# Altium project Rocket_PCB_Project_2017_Interface_board.PrjPcb
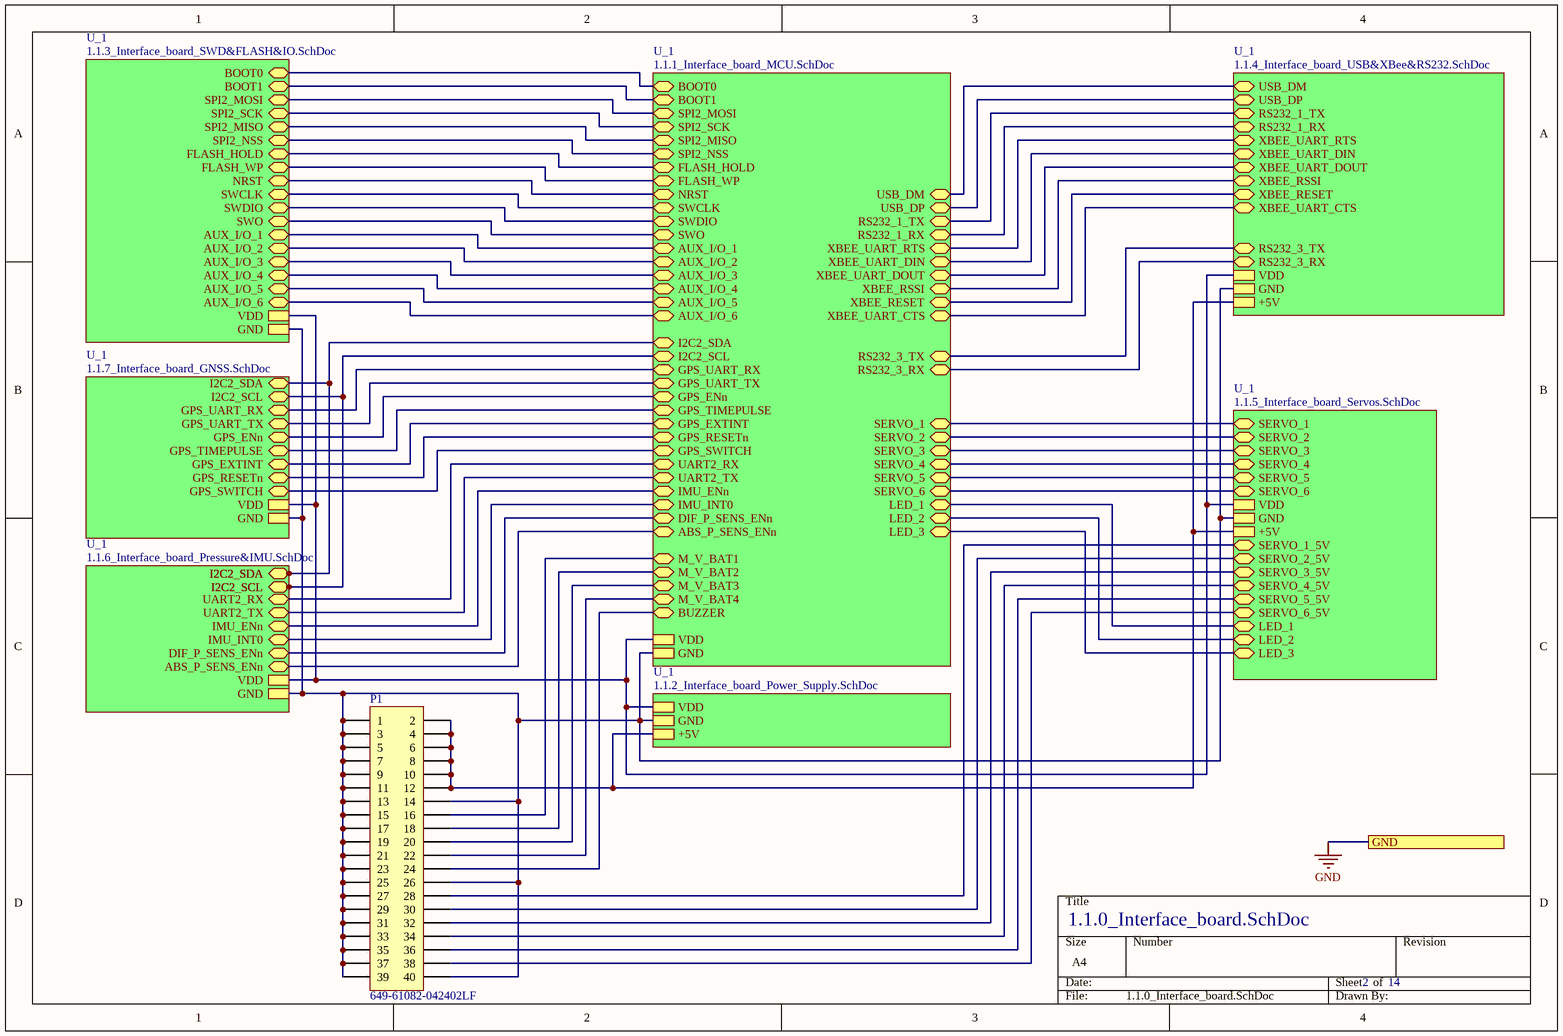
[diagram p0: 1.1.0_Interface_board.SchDoc]
8 sheets, 260 parts. Net scope: hierarchical (ports join the sheet entries above them; power ports are global).
Board file: Interface_board.PcbDoc
Sheets:
  1.1.0_Interface_board.SchDoc
    U_1 = 1.1.1_Interface_board_MCU.SchDoc
    U_1 = 1.1.2_Interface_board_Power_Supply.SchDoc
    U_1 = 1.1.3_Interface_board_SWD&FLASH&IO.SchDoc
    U_1 = 1.1.4_Interface_board_USB&XBee&RS232.SchDoc
    U_1 = 1.1.5_Interface_board_Servos.SchDoc
    U_1 = 1.1.6_Interface_board_Pressure&IMU.SchDoc
    U_1 = 1.1.7_Interface_board_GNSS.SchDoc

## Sheet 1.1.0_Interface_board.SchDoc
size A4; DocumentNumber: 2; SheetNumber: 2; SheetTotal: 14

### Parts
P1  Supplier Part Number 1: 649-61082-042402LF  [61082-042402LF]  (hidden comment: 61082-042402LF)

### Sub-sheets
U_1 = 1.1.1_Interface_board_MCU.SchDoc: USB_DM (bidir), USB_DP (bidir), SWO (bidir), SWCLK (bidir), SWDIO (bidir), BOOT0 (bidir), NRST (bidir), BOOT1 (bidir), I2C2_SCL (bidir), I2C2_SDA (bidir), RS232_1_TX (bidir), RS232_1_RX (bidir), SPI2_MOSI (bidir), SPI2_SCK (bidir), SPI2_MISO (bidir), SPI2_NSS (bidir), FLASH_WP (bidir), FLASH_HOLD (bidir), M_V_BAT2 (bidir), GPS_SWITCH (bidir), GPS_RESETn (bidir), M_V_BAT1 (bidir), ABS_P_SENS_ENn (bidir), DIF_P_SENS_ENn (bidir), SERVO_1 (bidir), SERVO_2 (bidir), SERVO_3 (bidir), SERVO_4 (bidir), SERVO_5 (bidir), SERVO_6 (bidir), GPS_UART_RX (bidir), GPS_UART_TX (bidir), UART2_TX (bidir), UART2_RX (bidir), RS232_3_TX (bidir), RS232_3_RX (bidir), XBEE_UART_RTS (bidir), XBEE_UART_CTS (bidir), XBEE_RESET (bidir), XBEE_UART_DIN (bidir), XBEE_UART_DOUT (bidir), M_V_BAT3 (bidir), AUX_I/O_2 (bidir), AUX_I/O_1 (bidir), AUX_I/O_3 (bidir), AUX_I/O_4 (bidir), BUZZER (bidir), AUX_I/O_5 (bidir), AUX_I/O_6 (bidir), XBEE_RSSI (bidir), VDD, GND, M_V_BAT4 (bidir), GPS_TIMEPULSE (bidir), GPS_ENn (bidir), GPS_EXTINT (bidir), IMU_INT0 (bidir), LED_1 (bidir), LED_2 (bidir), LED_3 (bidir), IMU_ENn (bidir)
U_1 = 1.1.2_Interface_board_Power_Supply.SchDoc: VDD, GND, +5V
U_1 = 1.1.3_Interface_board_SWD&FLASH&IO.SchDoc: BOOT0 (bidir), BOOT1 (bidir), SPI2_MOSI (bidir), SPI2_SCK (bidir), SPI2_MISO (bidir), SPI2_NSS (bidir), FLASH_HOLD (bidir), FLASH_WP (bidir), NRST (bidir), SWCLK (bidir), SWDIO (bidir), SWO (bidir), AUX_I/O_2 (bidir), AUX_I/O_1 (bidir), AUX_I/O_3 (bidir), AUX_I/O_4 (bidir), AUX_I/O_5 (bidir), AUX_I/O_6 (bidir), VDD, GND
U_1 = 1.1.4_Interface_board_USB&XBee&RS232.SchDoc: USB_DM (bidir), USB_DP (bidir), RS232_1_TX (bidir), RS232_1_RX (bidir), XBEE_UART_RTS (bidir), XBEE_UART_DIN (bidir), XBEE_UART_DOUT (bidir), XBEE_RSSI (bidir), XBEE_RESET (bidir), RS232_3_TX (bidir), RS232_3_RX (bidir), XBEE_UART_CTS (bidir), VDD, GND, +5V
U_1 = 1.1.5_Interface_board_Servos.SchDoc: SERVO_1 (bidir), SERVO_2 (bidir), SERVO_3 (bidir), SERVO_4 (bidir), SERVO_5 (bidir), SERVO_6 (bidir), VDD, GND, +5V, SERVO_1_5V (bidir), SERVO_2_5V (bidir), SERVO_3_5V (bidir), SERVO_4_5V (bidir), SERVO_5_5V (bidir), SERVO_6_5V (bidir), LED_1 (bidir), LED_2 (bidir), LED_3 (bidir)
U_1 = 1.1.6_Interface_board_Pressure&IMU.SchDoc: I2C2_SCL (bidir), I2C2_SDA (bidir), ABS_P_SENS_ENn (bidir), DIF_P_SENS_ENn (bidir), VDD, GND, UART2_TX (bidir), UART2_RX (bidir), IMU_INT0 (bidir), IMU_ENn (bidir), I2C2_SCL (bidir), I2C2_SDA (bidir), I2C2_SCL (bidir), I2C2_SDA (bidir)
U_1 = 1.1.7_Interface_board_GNSS.SchDoc: I2C2_SCL (bidir), I2C2_SDA (bidir), GPS_UART_RX (bidir), GPS_UART_TX (bidir), GPS_SWITCH (bidir), GPS_RESETn (bidir), GPS_EXTINT (bidir), GPS_ENn (bidir), GPS_TIMEPULSE (bidir), VDD, GND

### Ports
GND

### Nets
+5V: P1.2 P1.4 P1.6 P1.8 P1.10 P1.12 ; sheet U_1/+5V, sheet U_1/+5V, sheet U_1/+5V
GND: P1.1 P1.3 P1.5 P1.7 P1.9 P1.11 P1.13 P1.14 P1.15 P1.17 P1.19 P1.21 P1.23 P1.25 P1.26 P1.27 P1.29 P1.31 P1.33 P1.35 P1.37 P1.39 P1.40 ; port GND, sheet U_1/GND, sheet U_1/GND, sheet U_1/GND, sheet U_1/GND, sheet U_1/GND, sheet U_1/GND, sheet U_1/GND
VDD: sheet U_1/VDD, sheet U_1/VDD, sheet U_1/VDD, sheet U_1/VDD, sheet U_1/VDD, sheet U_1/VDD, sheet U_1/VDD
ABS_P_SENS_ENn: sheet U_1/ABS_P_SENS_ENn, sheet U_1/ABS_P_SENS_ENn
ADC123_IN1: P1.16 ; sheet U_1/M_V_BAT1
ADC123_IN2: P1.18 ; sheet U_1/M_V_BAT2
ADC123_IN3: P1.20 ; sheet U_1/M_V_BAT3
ADC123_IN4: P1.22 ; sheet U_1/M_V_BAT4
AUX_I/O_1: sheet U_1/AUX_I/O_1, sheet U_1/AUX_I/O_1
AUX_I/O_2: sheet U_1/AUX_I/O_2, sheet U_1/AUX_I/O_2
AUX_I/O_3: sheet U_1/AUX_I/O_3, sheet U_1/AUX_I/O_3
AUX_I/O_4: sheet U_1/AUX_I/O_4, sheet U_1/AUX_I/O_4
AUX_I/O_5: sheet U_1/AUX_I/O_5, sheet U_1/AUX_I/O_5
AUX_I/O_6: sheet U_1/AUX_I/O_6, sheet U_1/AUX_I/O_6
BOOT0: sheet U_1/BOOT0, sheet U_1/BOOT0
BOOT1: sheet U_1/BOOT1, sheet U_1/BOOT1
BUZZER: P1.24 ; sheet U_1/BUZZER
DIF_P_SENS_ENn: sheet U_1/DIF_P_SENS_ENn, sheet U_1/DIF_P_SENS_ENn
FLASH_HOLD: sheet U_1/FLASH_HOLD, sheet U_1/FLASH_HOLD
FLASH_WP: sheet U_1/FLASH_WP, sheet U_1/FLASH_WP
GPS_ENn: sheet U_1/GPS_ENn, sheet U_1/GPS_ENn
GPS_EXTINT: sheet U_1/GPS_EXTINT, sheet U_1/GPS_EXTINT
GPS_RESETn: sheet U_1/GPS_RESETn, sheet U_1/GPS_RESETn
GPS_SWITCH: sheet U_1/GPS_SWITCH, sheet U_1/GPS_SWITCH
GPS_TIMEPULSE: sheet U_1/GPS_TIMEPULSE, sheet U_1/GPS_TIMEPULSE
I2C2_SCL: sheet U_1/I2C2_SCL, sheet U_1/I2C2_SCL, sheet U_1/I2C2_SCL, sheet U_1/I2C2_SCL, sheet U_1/I2C2_SCL
I2C2_SDA: sheet U_1/I2C2_SDA, sheet U_1/I2C2_SDA, sheet U_1/I2C2_SDA, sheet U_1/I2C2_SDA, sheet U_1/I2C2_SDA
IMU_ENn: sheet U_1/IMU_ENn, sheet U_1/IMU_ENn
IMU_INT0: sheet U_1/IMU_INT0, sheet U_1/IMU_INT0
LED_1: sheet U_1/LED_1, sheet U_1/LED_1
LED_2: sheet U_1/LED_2, sheet U_1/LED_2
LED_3: sheet U_1/LED_3, sheet U_1/LED_3
NRST: sheet U_1/NRST, sheet U_1/NRST
OTG_FS_DM: sheet U_1/USB_DM, sheet U_1/USB_DM
OTG_FS_DP: sheet U_1/USB_DP, sheet U_1/USB_DP
SPI2_MISO: sheet U_1/SPI2_MISO, sheet U_1/SPI2_MISO
SPI2_MOSI: sheet U_1/SPI2_MOSI, sheet U_1/SPI2_MOSI
SPI2_NSS: sheet U_1/SPI2_NSS, sheet U_1/SPI2_NSS
SPI2_SCK: sheet U_1/SPI2_SCK, sheet U_1/SPI2_SCK
SWCLK: sheet U_1/SWCLK, sheet U_1/SWCLK
SWDIO: sheet U_1/SWDIO, sheet U_1/SWDIO
SWO: sheet U_1/SWO, sheet U_1/SWO
TIM1_CH1: sheet U_1/SERVO_3, sheet U_1/SERVO_3
TIM1_CH2: sheet U_1/SERVO_4, sheet U_1/SERVO_4
TIM1_CH3: sheet U_1/SERVO_5, sheet U_1/SERVO_5
TIM1_CH4: sheet U_1/SERVO_6, sheet U_1/SERVO_6
TIM9_CH1: sheet U_1/SERVO_1, sheet U_1/SERVO_1
TIM9_CH2: sheet U_1/SERVO_2, sheet U_1/SERVO_2
UART2_RX: sheet U_1/UART2_RX, sheet U_1/UART2_RX
UART2_TX: sheet U_1/UART2_TX, sheet U_1/UART2_TX
UART6_RX: sheet U_1/GPS_UART_RX, sheet U_1/GPS_UART_RX
UART6_TX: sheet U_1/GPS_UART_TX, sheet U_1/GPS_UART_TX
USART1_RX: sheet U_1/RS232_3_RX, sheet U_1/RS232_3_RX
USART1_TX: sheet U_1/RS232_3_TX, sheet U_1/RS232_3_TX
USART3_CTS: sheet U_1/XBEE_UART_CTS, sheet U_1/XBEE_UART_CTS
USART3_RTS: sheet U_1/XBEE_UART_RTS, sheet U_1/XBEE_UART_RTS
USART3_RX: sheet U_1/XBEE_UART_DIN, sheet U_1/XBEE_UART_DIN
USART3_TX: sheet U_1/XBEE_UART_DOUT, sheet U_1/XBEE_UART_DOUT
USART4_RX: sheet U_1/RS232_1_RX, sheet U_1/RS232_1_RX
USART4_TX: sheet U_1/RS232_1_TX, sheet U_1/RS232_1_TX
XBEE_RESET: sheet U_1/XBEE_RESET, sheet U_1/XBEE_RESET
XBEE_RSSI: sheet U_1/XBEE_RSSI, sheet U_1/XBEE_RSSI
NetP1_28: P1.28 ; sheet U_1/SERVO_1_5V
NetP1_30: P1.30 ; sheet U_1/SERVO_2_5V
NetP1_32: P1.32 ; sheet U_1/SERVO_3_5V
NetP1_34: P1.34 ; sheet U_1/SERVO_4_5V
NetP1_36: P1.36 ; sheet U_1/SERVO_5_5V
NetP1_38: P1.38 ; sheet U_1/SERVO_6_5V

### Library data of the parts
P1 = 61082-042402LF: Connecteurs carte à carte et mezzanine 40P RECPT; Supplier 1: Mouser

## Sheet 1.1.1_Interface_board_MCU.SchDoc
size A4; DocumentNumber: 3; SheetNumber: 3; SheetTotal: 14
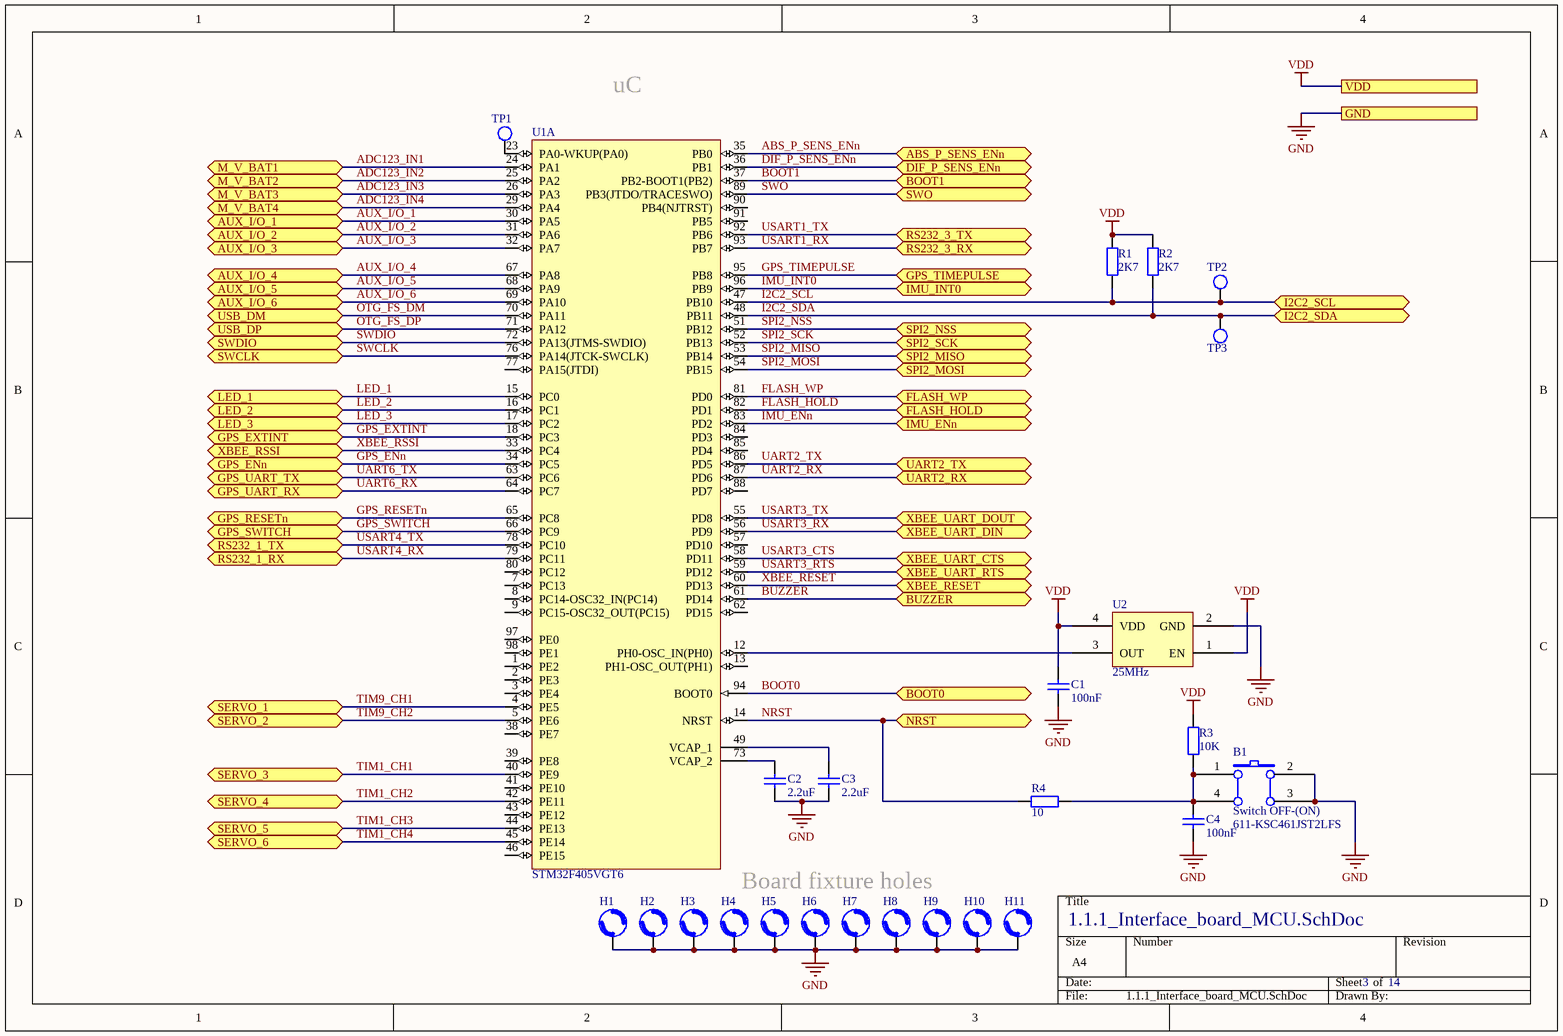
[diagram p1: 1.1.1_Interface_board_MCU.SchDoc]

### Parts
B1  Switch OFF-(ON)  Supplier Part Number 1: 611-KSC461JST2LFS  [Switch CK]
C1  100nF  [CAP0603R]
C2  2.2uF  [CAP1206W]
C3  2.2uF  [CAP1206W]
C4  100nF  [CAP0603R]
H1  Hole_3.2mm  [HOLE_3.2mm]  (value not drawn)
H2  Hole_3.2mm  [HOLE_3.2mm]  (value not drawn)
H3  Hole_3.2mm  [HOLE_3.2mm]  (value not drawn)
H4  Hole_3.2mm  [HOLE_3.2mm]  (value not drawn)
H5  Hole_3.2mm  [HOLE_3.2mm]  (value not drawn)
H6  Hole_3.2mm  [HOLE_3.2mm]  (value not drawn)
H7  Hole_3.2mm  [HOLE_3.2mm]  (value not drawn)
H8  Hole_3.2mm  [HOLE_3.2mm]  (value not drawn)
H9  Hole_3.2mm  [HOLE_3.2mm]  (value not drawn)
H10  Hole_3.2mm  [HOLE_3.2mm]  (value not drawn)
H11  Hole_3.2mm  [HOLE_3.2mm]  (value not drawn)
R1  2K7  [0603]
R2  2K7  [0603]
R3  10K  [0603]
R4  10  [0603]
TP1  Test point  [TP]  (value not drawn)
TP2  Test point  [TP]  (value not drawn)
TP3  Test point  [TP]  (value not drawn)
U1  STM32F405VGT6  [STM-LQFP100_N]  (part A of 2)
U2  25MHz  [SMD_3.2X2.5MM_4P]

### Ports
ABS_P_SENS_ENn (bidir), AUX_I/O_1 (bidir), AUX_I/O_2 (bidir), AUX_I/O_3 (bidir), AUX_I/O_4 (bidir), AUX_I/O_5 (bidir), AUX_I/O_6 (bidir), BOOT0 (bidir), BOOT1 (bidir), BUZZER (bidir), DIF_P_SENS_ENn (bidir), FLASH_HOLD (bidir), FLASH_WP (bidir), GND, GPS_ENn (bidir), GPS_EXTINT (bidir), GPS_RESETn (bidir), GPS_SWITCH (bidir), GPS_TIMEPULSE (bidir), GPS_UART_RX (bidir), GPS_UART_TX (bidir), I2C2_SCL (bidir), I2C2_SDA (bidir), IMU_ENn (bidir), IMU_INT0 (bidir), LED_1 (bidir), LED_2 (bidir), LED_3 (bidir), M_V_BAT1 (bidir), M_V_BAT2 (bidir), M_V_BAT3 (bidir), M_V_BAT4 (bidir), NRST (bidir), RS232_1_RX (bidir), RS232_1_TX (bidir), RS232_3_RX (bidir), RS232_3_TX (bidir), SERVO_1 (bidir), SERVO_2 (bidir), SERVO_3 (bidir), SERVO_4 (bidir), SERVO_5 (bidir), SERVO_6 (bidir), SPI2_MISO (bidir), SPI2_MOSI (bidir), SPI2_NSS (bidir), SPI2_SCK (bidir), SWCLK (bidir), SWDIO (bidir), SWO (bidir), UART2_RX (bidir), UART2_TX (bidir), USB_DM (bidir), USB_DP (bidir), VDD, XBEE_RESET (bidir), XBEE_RSSI (bidir), XBEE_UART_CTS (bidir), XBEE_UART_DIN (bidir), XBEE_UART_DOUT (bidir), XBEE_UART_RTS (bidir)

### Nets
GND: B1.2(B0) B1.3(B1) C1.1 C2.1 C3.1 C4.2 H1.0 H2.0 H3.0 H4.0 H5.0 H6.0 H7.0 H8.0 H9.0 H10.0 H11.0 U2.2(GND) ; port GND
VDD: C1.2 R1.2 R2.2 R3.2 U2.1(EN) U2.4(VDD) ; port VDD
ABS_P_SENS_ENn: U1.35(PB0) ; port ABS_P_SENS_ENn
ADC123_IN1: U1.24(PA1) ; port M_V_BAT1
ADC123_IN2: U1.25(PA2) ; port M_V_BAT2
ADC123_IN3: U1.26(PA3) ; port M_V_BAT3
ADC123_IN4: U1.29(PA4) ; port M_V_BAT4
AUX_I/O_1: U1.30(PA5) ; port AUX_I/O_1
AUX_I/O_2: U1.31(PA6) ; port AUX_I/O_2
AUX_I/O_3: U1.32(PA7) ; port AUX_I/O_3
AUX_I/O_4: U1.67(PA8) ; port AUX_I/O_4
AUX_I/O_5: U1.68(PA9) ; port AUX_I/O_5
AUX_I/O_6: U1.69(PA10) ; port AUX_I/O_6
BOOT0: U1.94(BOOT0) ; port BOOT0
BOOT1: U1.37(PB2-BOOT1(PB2)) ; port BOOT1
BUZZER: U1.61(PD14) ; port BUZZER
DIF_P_SENS_ENn: U1.36(PB1) ; port DIF_P_SENS_ENn
FLASH_HOLD: U1.82(PD1) ; port FLASH_HOLD
FLASH_WP: U1.81(PD0) ; port FLASH_WP
GPS_ENn: U1.34(PC5) ; port GPS_ENn
GPS_EXTINT: U1.18(PC3) ; port GPS_EXTINT
GPS_RESETn: U1.65(PC8) ; port GPS_RESETn
GPS_SWITCH: U1.66(PC9) ; port GPS_SWITCH
GPS_TIMEPULSE: U1.95(PB8) ; port GPS_TIMEPULSE
I2C2_SCL: R1.1 TP2.1 U1.47(PB10) ; port I2C2_SCL
I2C2_SDA: R2.1 TP3.1 U1.48(PB11) ; port I2C2_SDA
IMU_ENn: U1.83(PD2) ; port IMU_ENn
IMU_INT0: U1.96(PB9) ; port IMU_INT0
LED_1: U1.15(PC0) ; port LED_1
LED_2: U1.16(PC1) ; port LED_2
LED_3: U1.17(PC2) ; port LED_3
NRST: R4.1 U1.14(NRST) ; port NRST
OTG_FS_DM: U1.70(PA11) ; port USB_DM
OTG_FS_DP: U1.71(PA12) ; port USB_DP
SPI2_MISO: U1.53(PB14) ; port SPI2_MISO
SPI2_MOSI: U1.54(PB15) ; port SPI2_MOSI
SPI2_NSS: U1.51(PB12) ; port SPI2_NSS
SPI2_SCK: U1.52(PB13) ; port SPI2_SCK
SWCLK: U1.76(PA14(JTCK-SWCLK)) ; port SWCLK
SWDIO: U1.72(PA13(JTMS-SWDIO)) ; port SWDIO
SWO: U1.89(PB3(JTDO/TRACESWO)) ; port SWO
TIM1_CH1: U1.40(PE9) ; port SERVO_3
TIM1_CH2: U1.42(PE11) ; port SERVO_4
TIM1_CH3: U1.44(PE13) ; port SERVO_5
TIM1_CH4: U1.45(PE14) ; port SERVO_6
TIM9_CH1: U1.4(PE5) ; port SERVO_1
TIM9_CH2: U1.5(PE6) ; port SERVO_2
UART2_RX: U1.87(PD6) ; port UART2_RX
UART2_TX: U1.86(PD5) ; port UART2_TX
UART6_RX: U1.64(PC7) ; port GPS_UART_RX
UART6_TX: U1.63(PC6) ; port GPS_UART_TX
USART1_RX: U1.93(PB7) ; port RS232_3_RX
USART1_TX: U1.92(PB6) ; port RS232_3_TX
USART3_CTS: U1.58(PD11) ; port XBEE_UART_CTS
USART3_RTS: U1.59(PD12) ; port XBEE_UART_RTS
USART3_RX: U1.56(PD9) ; port XBEE_UART_DIN
USART3_TX: U1.55(PD8) ; port XBEE_UART_DOUT
USART4_RX: U1.79(PC11) ; port RS232_1_RX
USART4_TX: U1.78(PC10) ; port RS232_1_TX
XBEE_RESET: U1.60(PD13) ; port XBEE_RESET
XBEE_RSSI: U1.33(PC4) ; port XBEE_RSSI
NetB1_1: B1.1(A0) B1.4(A1) C4.1 R3.1 R4.2
NetC2_2: C2.2 U1.73(VCAP_2)
NetC3_2: C3.2 U1.49(VCAP_1)
NetTP1_1: TP1.1 U1.23(PA0-WKUP(PA0))
NetU1_12: U1.12(PH0-OSC_IN(PH0)) U2.3(OUT)

Not connected (* = marked no-connect by the designer): U1 1(PE2) 2(PE3) 3(PE4) 7(PC13) 8(PC14-OSC32_IN(PC14)) 9(PC15-OSC32_OUT(PC15)) 13(PH1-OSC_OUT(PH1)) 38(PE7) 39(PE8) 41(PE10) 43(PE12) 46(PE15) 57(PD10) 62(PD15) 77(PA15(JTDI)) 80(PC12) 84(PD3) 85(PD4) 88(PD7) 90(PB4(NJTRST)) 91(PB5) 97(PE0) 98(PE1)

### Notes on the sheet
- uC
- Board fixture holes

### Library data of the parts
B1 = Switch OFF-(ON): OFF-(ON); Supplier 1: Mouser
C1 C4 = C_100nF: Capacitor; Supplier 1: Mouser; Supplier Part Number 1: 81-GCG188R91H104KA1D
C2 C3 = C_2.2uF_1206: Capacitor; Supplier 1: Mouser; Supplier Part Number 1: 81-GCG31MR71E225JA2L
R1 R2 = R_0603_01W_2K7: 0.1W 2K7; Supplier 1: Mouser; Supplier Part Number 1: 667-ERJ-3EKF2701V
R3 = R_0603_01W_10K: 0.1W 10K; Supplier 1: Mouser; Supplier Part Number 1: 667-ERJ-3GEYJ103V
R4 = R_0603_025W_10Ohm: 0.25W 10Ohm; Supplier 1: Mouser; Supplier Part Number 1: 667-ERJ-PA3J100V
U1 = STM32F405VGT6: ARM Cortex-M4 32-bit MCU+FPU, 210 DMIPS, 1024 kB Flash, 192 kB Internal RAM, 82 I/Os, 100-pin LQFP, -40 to 85 degC, Tray; Manufacturer: STMicroelectronics; D/A Converter: 2x12-bit; FLASH Size (Prog) (kB): 1024; I/Os (High Current): 82; Internal RAM Size (kB): 192; Operating Frequency(F) (Processor speed) (MHz): 168; Supply Voltage(Vcc) max (V): 3.6; Supply Voltage(Vcc) min (V): 1.8; DatasheetVersion: Rev. 4; PackageVersion: Rev. 1, 06/2013; PackageReference: LQFP100; PackageDescription: 100-Pin Low Profile Quad Flat Package, 14 x 14 mm Body, 0.5 mm Pitch; Supplier 1: Digi-Key; Supplier Part Number 1: 497-11910-ND; Supplier 2: Farnell; Supplier Part Number 2: 2215224; Supplier 3: Newark; Supplier Part Number 3: 46W2199; Supplier 4: Newark; Supplier Part Number 4: 94T6493; Supplier 5: Mouser; Supplier Part Number 5: 511-STM32F405VGT6; Core: ARM Cortex-M4; Packing: Tray; Mounting Technology: Surface Mount; PartNumber: STM32F405VGT6; ComponentLink1Description: Manufacturer URL; ComponentLink1URL: http://www.st.com/web/en/home.html; ComponentLink2Description: Datasheet; ComponentLink2URL: http://www.st.com/st-web-ui/static/active/en/resource/technical/document/datasheet/DM00037051.pdf; ComponentLink3Description: Package Specification; ComponentLink3URL: http://www.st.com/st-web-ui/static/active/en/resource/technical/document/data_brief/DM00071938.pdf
U2 = DSC1001CI2-025.0000: Osc; Supplier 1: Mouser; Supplier Part Number 1: 998-1001CI2025.0000T

## Sheet 1.1.2_Interface_board_Power_Supply.SchDoc
size A4; DocumentNumber: 4; SheetNumber: 4; SheetTotal: 14
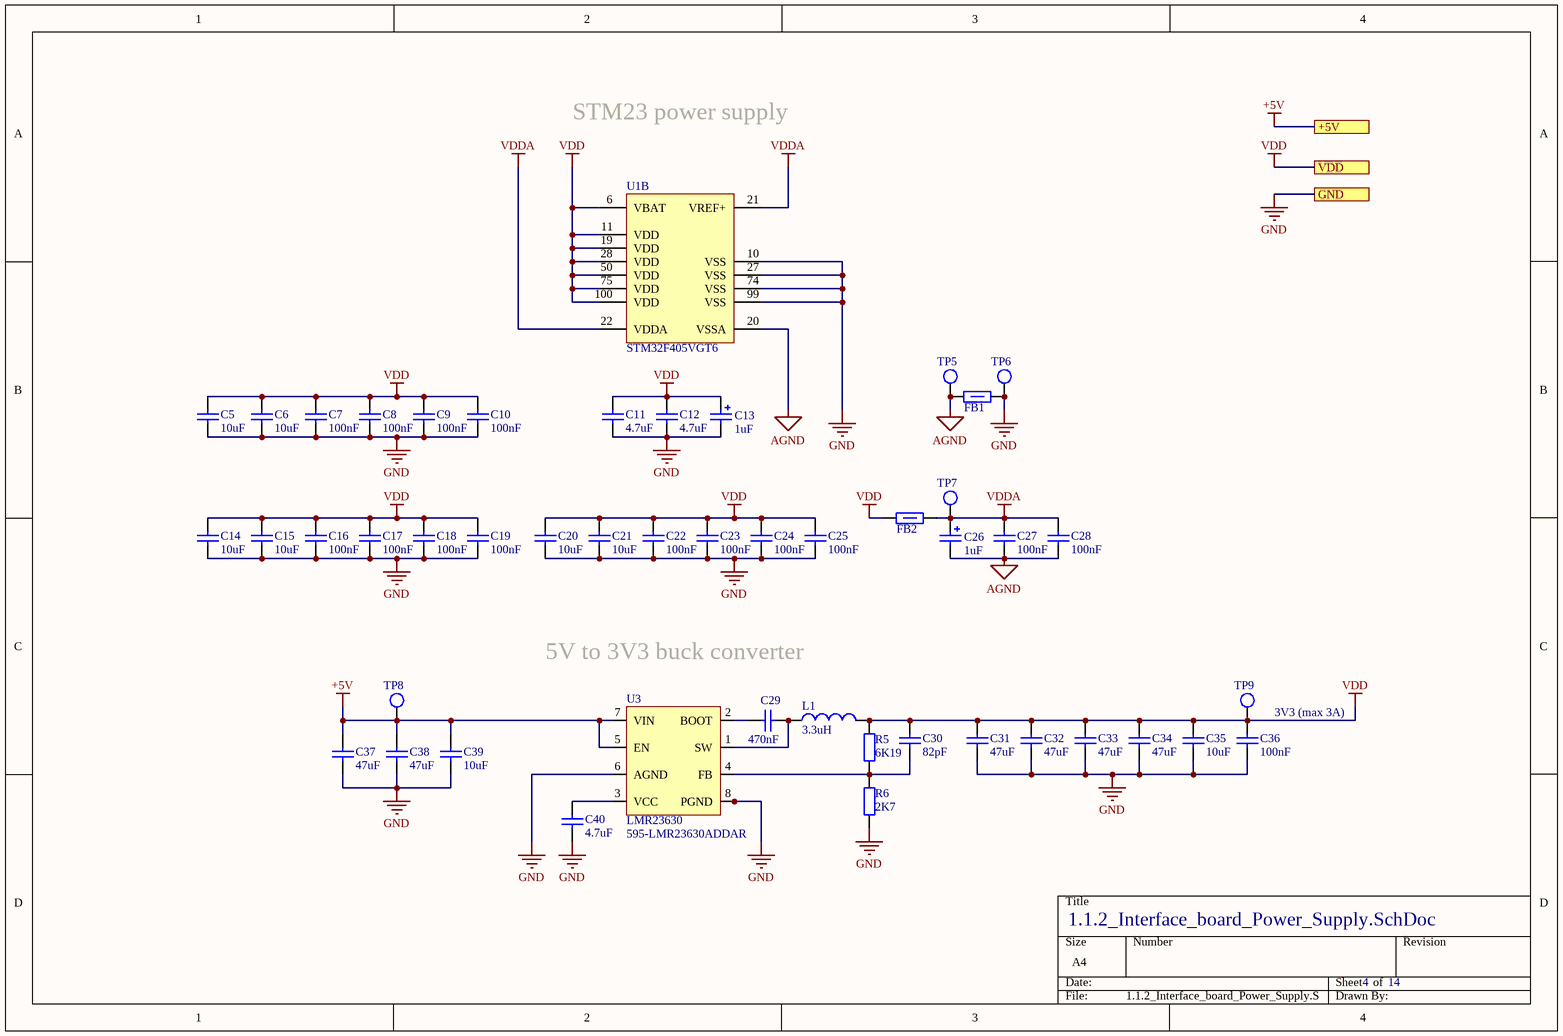
[diagram p2: 1.1.2_Interface_board_Power_Supply.SchDoc]

### Parts
C5  10uF  [CAP0805W]
C6  10uF  [CAP0805W]
C7  100nF  [CAP0603R]
C8  100nF  [CAP0603R]
C9  100nF  [CAP0603R]
C10  100nF  [CAP0603R]
C11  4.7uF  [CAP0805W]
C12  4.7uF  [CAP0805W]
C13  1uF  [CAP1206-case_A]
C14  10uF  [CAP0805W]
C15  10uF  [CAP0805W]
C16  100nF  [CAP0603R]
C17  100nF  [CAP0603R]
C18  100nF  [CAP0603R]
C19  100nF  [CAP0603R]
C20  10uF  [CAP0805W]
C21  10uF  [CAP0805W]
C22  100nF  [CAP0603R]
C23  100nF  [CAP0603R]
C24  100nF  [CAP0603R]
C25  100nF  [CAP0603R]
C26  1uF  [CAP1206-case_A]
C27  100nF  [CAP0603R]
C28  100nF  [CAP0603R]
C29  470nF  [CAP0603R]
C30  82pF  [CAP0603R]
C31  47uF  [CAP1206W]
C32  47uF  [CAP1206W]
C33  47uF  [CAP1206W]
C34  47uF  [CAP1206W]
C35  10uF  [CAP0805W]
C36  100nF  [CAP0603R]
C37  47uF  [CAP1206W]
C38  47uF  [CAP1206W]
C39  10uF  [CAP0805W]
C40  4.7uF  [CAP0805W]
FB1  81-BLM18KG601SZ1D  [0603]  (value not drawn)
FB2  81-BLM18KG601SZ1D  [0603]  (value not drawn)
L1  3.3uH  [IHLP-2525CZ-01_Inductor]
R5  6K19  [0603]
R6  2K7  [0603]
TP5  Test point  [TP]  (value not drawn)
TP6  Test point  [TP]  (value not drawn)
TP7  Test point  [TP]  (value not drawn)
TP8  Test point  [TP]  (value not drawn)
TP9  Test point  [TP]  (value not drawn)
U1  STM32F405VGT6  [STM-LQFP100_N]  (part B of 2)
U3  LMR23630  Supplier Part Number 1: 595-LMR23630ADDAR  [HSOIC-8]

### Ports
+5V, GND, VDD

### Nets
+5V: C37.2 C38.2 C39.2 TP8.1 U3.5(EN) U3.7(VIN) ; port +5V
AGND: C26.2 C27.1 C28.1 FB1.1 TP5.1 U1.20(VSSA)
GND: C5.1 C6.1 C7.1 C8.1 C9.1 C10.1 C11.1 C12.1 C13.2 C14.1 C15.1 C16.1 C17.1 C18.1 C19.1 C20.1 C21.1 C22.1 C23.1 C24.1 C25.1 C31.1 C32.1 C33.1 C34.1 C35.1 C36.1 C37.1 C38.1 C39.1 C40.1 FB1.2 R6.1 TP6.1 U1.10(VSS) U1.27(VSS) U1.74(VSS) U1.99(VSS) U3.6(AGND) U3.8(PGND) U3.PD(PGND) ; port GND
VDD: C5.2 C6.2 C7.2 C8.2 C9.2 C10.2 C11.2 C12.2 C13.1 C14.2 C15.2 C16.2 C17.2 C18.2 C19.2 C20.2 C21.2 C22.2 C23.2 C24.2 C25.2 C30.2 C31.2 C32.2 C33.2 C34.2 C35.2 C36.2 FB2.1 L1.2 R5.2 TP9.1 U1.6(VBAT) U1.11(VDD) U1.19(VDD) U1.28(VDD) U1.50(VDD) U1.75(VDD) U1.100(VDD) ; port VDD
VDDA: C26.1 C27.2 C28.2 FB2.2 TP7.1 U1.21(VREF+) U1.22(VDDA)
NetC29_1: C29.1 L1.1 U3.1(SW)
NetC29_2: C29.2 U3.2(BOOT)
NetC30_1: C30.1 R5.1 R6.2 U3.4(FB)
NetC40_2: C40.2 U3.3(VCC)

### Notes on the sheet
- STM23 power supply
- 5V to 3V3 buck converter
- 3V3 (max 3A)

### Library data of the parts
C5 C6 C14 C15 C20 C21 C35 C39 = C_10uF_16v: Capacitor; Supplier 1: Mouser; Supplier Part Number 1: 81-GRT21BC81C106ME1L
C7-C10 C16-C19 C22-C25 C27 C28 C36 = C_100nF: Capacitor; Supplier 1: Mouser; Supplier Part Number 1: 81-GCG188R91H104KA1D
C11 C12 = C_4.7uF: Capacitor; Supplier 1: Mouser; Supplier Part Number 1: 81-GCG21BR71C475KA2L
C13 C26 = C_pol_1uF_tental: Polarized Capacitor; Revision: July-2002: Re-released for DXP Platform.; Supplier 1: Mouser; Supplier Part Number 1: 581-TAJA105K016
C29 = C_470nF_25v: Capacitor; Supplier 1: Mouser; Supplier Part Number 1: 81-GRT188R61E474KE3D
C30 = C_82pF_50V: Capacitor; Supplier 1: Mouser; Supplier Part Number 1: 81-GCM1885C1H820JA6D
C31-C34 C37 C38 = C_47uF_25v_1206: Capacitor; Supplier 1: Mouser; Supplier Part Number 1: 810-C3216X5R1E476M
C40 = C_4.7uF_16v: Capacitor; Supplier 1: Mouser; Supplier Part Number 1: 81-GCG21BR71C475KA2L
FB1 FB2 = Ferrite_bead: Supplier 1: Mouser; Supplier Part Number 1: 81-BLM18KG601SZ1D
L1 = L_3.3uH_6A: Inductors 3.3uH 20%; Supplier 1: Mouser; Supplier Part Number 1: 70-IHLP2525CZER3R3M0
R5 = R_0603_01W_6K2: 0.1W 6K19; Supplier 1: Mouser; Supplier Part Number 1: 667-ERJ-3EKF6191V
R6 = R_0603_01W_2K7: 0.1W 2K7; Supplier 1: Mouser; Supplier Part Number 1: 667-ERJ-3EKF2701V
U1 = STM32F405VGT6: as U1 on sheet 1.1.1_Interface_board_MCU; DatasheetVersion: Rev. 4; PackageVersion: Rev. 1, 06/2013; PackageReference: LQFP100; PackageDescription: 100-Pin Low Profile Quad Flat Package, 14 x 14 mm Body, 0.5 mm Pitch; Supplier 1: Digi-Key; Supplier Part Number 1: 497-11910-ND; Supplier 2: Farnell; Supplier Part Number 2: 2215224; Supplier 3: Newark; Supplier Part Number 3: 46W2199; Supplier 4: Newark; Supplier Part Number 4: 94T6493; Supplier 5: Mouser; Supplier Part Number 5: 511-STM32F405VGT6; Core: ARM Cortex-M4; Packing: Tray; Mounting Technology: Surface Mount; PartNumber: STM32F405VGT6; ComponentLink1Description: Manufacturer URL; ComponentLink1URL: http://www.st.com/web/en/home.html; ComponentLink2Description: Datasheet; ComponentLink2URL: http://www.st.com/st-web-ui/static/active/en/resource/technical/document/datasheet/DM00037051.pdf; ComponentLink3Description: Package Specification; ComponentLink3URL: http://www.st.com/st-web-ui/static/active/en/resource/technical/document/data_brief/DM00071938.pdf
U3 = LMR23630: Voltage regulator 3A; Supplier 1: Mouser

## Sheet 1.1.3_Interface_board_SWD&FLASH&IO.SchDoc
size A4; DocumentNumber: 5; SheetNumber: 5; SheetTotal: 14
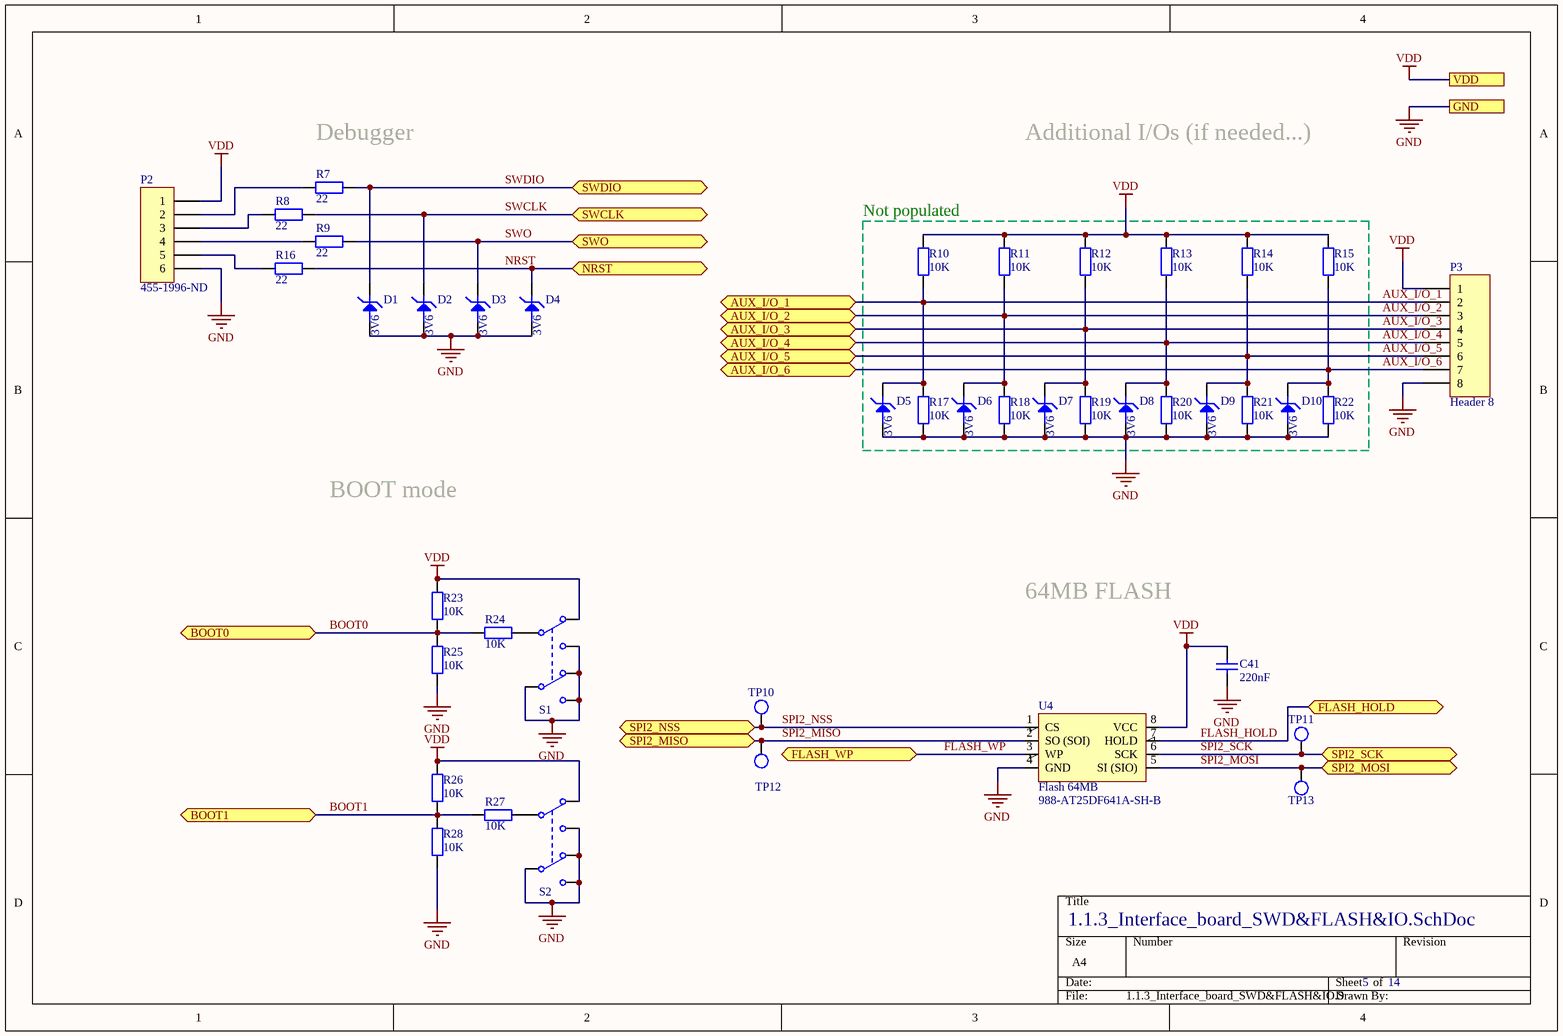
[diagram p3: 1.1.3_Interface_board_SWD&FLASH&IO.SchDoc]

### Parts
C41  220nF  [CAP0603R]
D1  3V6  [SOT23]
D2  3V6  [SOT23]
D3  3V6  [SOT23]
D4  3V6  [SOT23]
D5  3V6  [SOT23]
D6  3V6  [SOT23]
D7  3V6  [SOT23]
D8  3V6  [SOT23]
D9  3V6  [SOT23]
D10  3V6  [SOT23]
P2  Supplier Part Number 1: 455-1996-ND  [CON_JST_XA_ B06B-XASK]  (hidden comment: Header 6p JST XA 3A)
P3  Header 8  [HDR1X8]
R7  22  [0603]
R8  22  [0603]
R9  22  [0603]
R10  10K  [0603]
R11  10K  [0603]
R12  10K  [0603]
R13  10K  [0603]
R14  10K  [0603]
R15  10K  [0603]
R16  22  [0603]
R17  10K  [0603]
R18  10K  [0603]
R19  10K  [0603]
R20  10K  [0603]
R21  10K  [0603]
R22  10K  [0603]
R23  10K  [0603]
R24  10K  [0603]
R25  10K  [0603]
R26  10K  [0603]
R27  10K  [0603]
R28  10K  [0603]
S1  SW DPDT  [SMD Slide Switches ON-ON]  (value not drawn)
S2  SW DPDT  [SMD Slide Switches ON-ON]  (value not drawn)
TP10  Test point  [TP]  (value not drawn)
TP11  Test point  [TP]  (value not drawn)
TP12  Test point  [TP]  (value not drawn)
TP13  Test point  [TP]  (value not drawn)
U4  Flash 64MB  Supplier Part Number 1: 988-AT25DF641A-SH-B  [SOIC-8]

### Blocks framed on the sheet
Not populated: D5-D10 R10-R15 R17-R22

### Ports
AUX_I/O_1 (bidir), AUX_I/O_2 (bidir), AUX_I/O_3 (bidir), AUX_I/O_4 (bidir), AUX_I/O_5 (bidir), AUX_I/O_6 (bidir), BOOT0 (bidir), BOOT1 (bidir), FLASH_HOLD (bidir), FLASH_WP (bidir), GND, NRST (bidir), SPI2_MISO (bidir), SPI2_MOSI (bidir), SPI2_NSS (bidir), SPI2_SCK (bidir), SWCLK (bidir), SWDIO (bidir), SWO (bidir), VDD

### Nets
GND: C41.1 D1.1 D2.1 D3.1 D4.1 D5.1 D6.1 D7.1 D8.1 D9.1 D10.1 P2.6 P3.8 R17.1 R18.1 R19.1 R20.1 R21.1 R22.1 R25.1 R28.1 S1.1(NO1) S1.4(NO2) S1.5(COMMON2) S1.6(NC2) S2.1(NO1) S2.4(NO2) S2.5(COMMON2) S2.6(NC2) U4.4(GND) ; port GND
VDD: C41.2 P2.1 P3.1 R10.2 R11.2 R12.2 R13.2 R14.2 R15.2 R23.2 R26.2 S1.3(NC1) S2.3(NC1) U4.8(VCC) ; port VDD
AUX_I/O_1: D5.3 P3.2 R10.1 R17.2 ; port AUX_I/O_1
AUX_I/O_2: D6.3 P3.3 R11.1 R18.2 ; port AUX_I/O_2
AUX_I/O_3: D7.3 P3.4 R12.1 R19.2 ; port AUX_I/O_3
AUX_I/O_4: D8.3 P3.5 R13.1 R20.2 ; port AUX_I/O_4
AUX_I/O_5: D9.3 P3.6 R14.1 R21.2 ; port AUX_I/O_5
AUX_I/O_6: D10.3 P3.7 R15.1 R22.2 ; port AUX_I/O_6
BOOT0: R23.1 R24.2 R25.2 ; port BOOT0
BOOT1: R26.1 R27.2 R28.2 ; port BOOT1
FLASH_HOLD: U4.7(HOLD) ; port FLASH_HOLD
FLASH_WP: U4.3(WP) ; port FLASH_WP
NRST: D4.3 R16.2 ; port NRST
SPI2_MISO: TP12.1 U4.2(SO_(SOI)) ; port SPI2_MISO
SPI2_MOSI: TP13.1 U4.5(SI_(SIO)) ; port SPI2_MOSI
SPI2_NSS: TP10.1 U4.1(CS) ; port SPI2_NSS
SPI2_SCK: TP11.1 U4.6(SCK) ; port SPI2_SCK
SWCLK: D2.3 R8.2 ; port SWCLK
SWDIO: D1.3 R7.2 ; port SWDIO
SWO: D3.3 R9.2 ; port SWO
NetP2_2: P2.2 R7.1
NetP2_3: P2.3 R8.1
NetP2_4: P2.4 R9.1
NetP2_5: P2.5 R16.1
NetR24_1: R24.1 S1.2(COMMON1)
NetR27_1: R27.1 S2.2(COMMON1)

### Notes on the sheet
- (near R7) Debugger
- Additional I/Os (if needed...)
- BOOT mode
- 64MB FLASH

### Library data of the parts
C41 = C_220nF: Capacitor; Supplier 1: Mouser; Supplier Part Number 1: 81-GCG188R91H224KA1D
D1-D10 = DZ_3V6_MMBZ522: Zener Diodes 3.6V 225mW; Supplier 1: Mouser; Supplier Part Number 1: 863-MMBZ5227BLT1G
P3 = Header 8: Header, 8-Pin; LatestRevisionDate: 17-Jul-2002; LatestRevisionNote: Re-released for DXP Platform.; Publisher: Altium Limited
R7-R9 R16 = R_0603_025W_22Ohm: 0.25W 22Ohm; LatestRevisionDate: 17-Jul-2002; LatestRevisionNote: Re-released for DXP Platform.; PackageReference: AXIAL-0.4; PackageDescription: Axial Device, Thru-Hole; 2 Leads; 0.4 in Pin Spacing; Supplier 1: Mouser; Supplier Part Number 1: 667-ERJ-PA3J220V
R10-R15 R17-R28 = R_0603_01W_10K: 0.1W 10K; Supplier 1: Mouser; Supplier Part Number 1: 667-ERJ-3GEYJ103V
S1 S2 = SW DPDT: Switch; Supplier: Mouser; Supplier Part Number: 688-SSSS820101
U4 = Flash 64MB SPI: Supplier 1: Mouser
P2 = Header 6p JST XA 3A: Supplier 1: Digi-Key

## Sheet 1.1.4_Interface_board_USB&XBee&RS232.SchDoc
size A4; DocumentNumber: 6; SheetNumber: 6; SheetTotal: 14
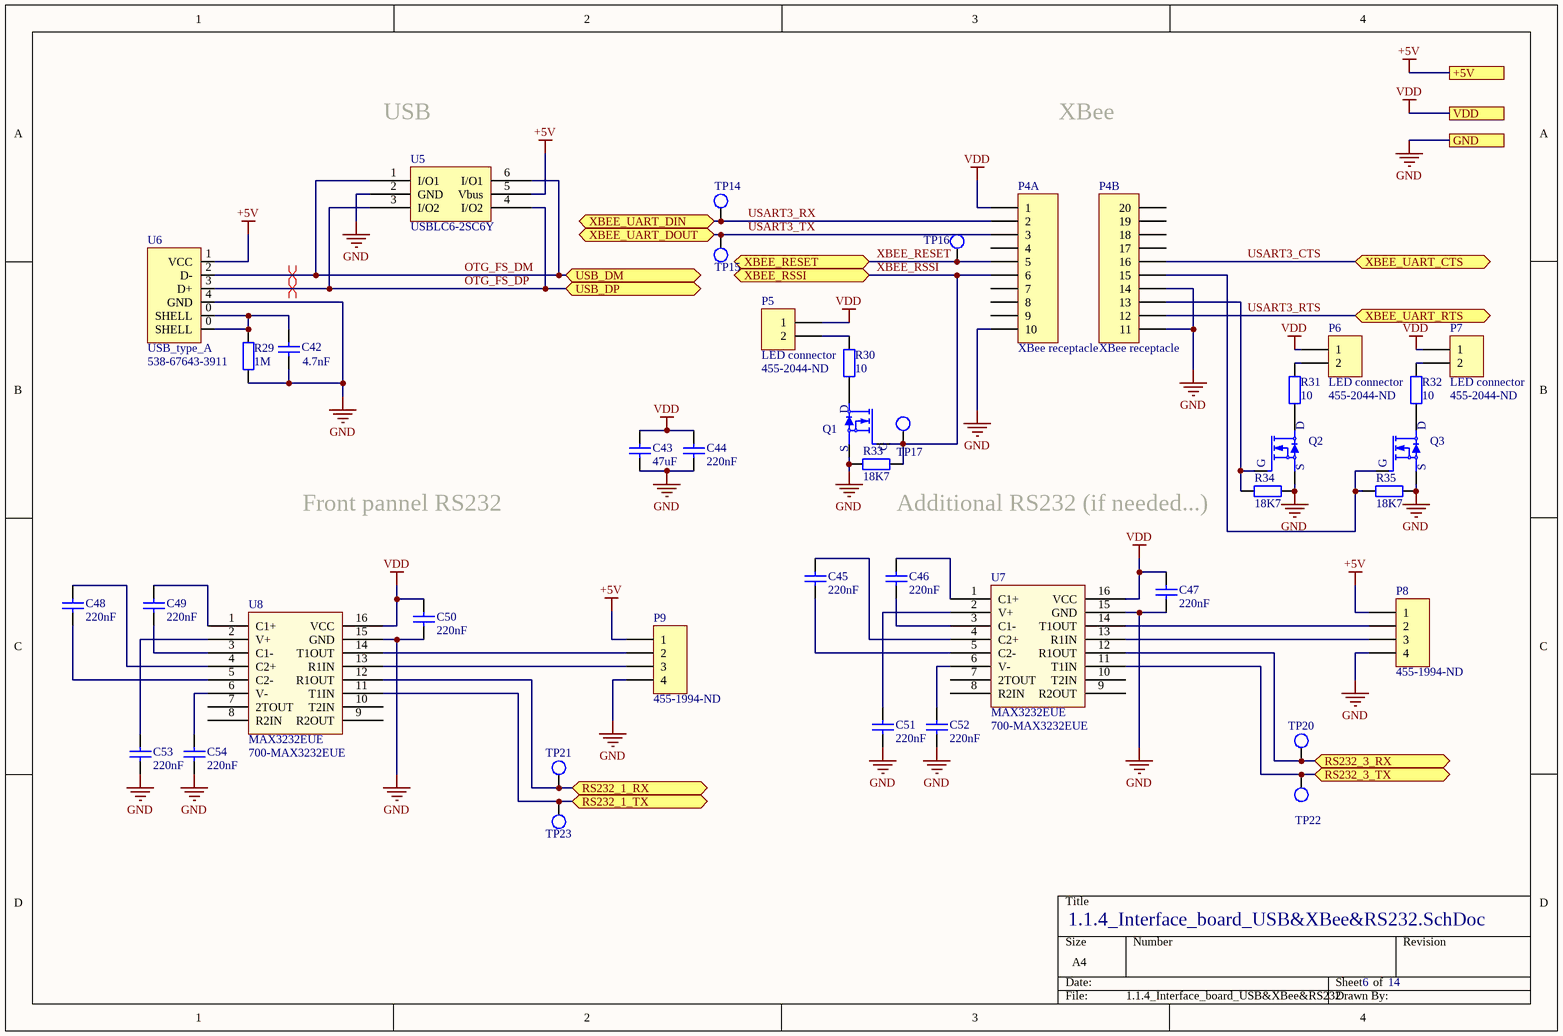
[diagram p4: 1.1.4_Interface_board_USB&XBee&RS232.SchDoc]

### Parts
C42  4.7nF  [CAP0603R]
C43  47uF  [CAP1206W]
C44  220nF  [CAP0603R]
C45  220nF  [CAP0603R]
C46  220nF  [CAP0603R]
C47  220nF  [CAP0603R]
C48  220nF  [CAP0603R]
C49  220nF  [CAP0603R]
C50  220nF  [CAP0603R]
C51  220nF  [CAP0603R]
C52  220nF  [CAP0603R]
C53  220nF  [CAP0603R]
C54  220nF  [CAP0603R]
P4  XBee receptacle  [XBee receptacle]  (parts A,B of 2)
P5  LED connector  Supplier Part Number 1: 455-2044-ND  [CON_JST_XA_ S02B-XASS-1]
P6  LED connector  Supplier Part Number 1: 455-2044-ND  [CON_JST_XA_ S02B-XASS-1]
P7  LED connector  Supplier Part Number 1: 455-2044-ND  [CON_JST_XA_ S02B-XASS-1]
P8  Supplier Part Number 1: 455-1994-ND  [CON_JST_XA_ B04B-XASK]  (hidden comment: Header 4p JST XA 3A)
P9  Supplier Part Number 1: 455-1994-ND  [CON_JST_XA_ B04B-XASK]  (hidden comment: Header 4p JST XA 3A)
Q1  MOSFET_N  [SOT-323-3]  (value not drawn)
Q2  MOSFET_N  [SOT-323-3]  (value not drawn)
Q3  MOSFET_N  [SOT-323-3]  (value not drawn)
R29  1M  [0603]
R30  10  [0603]
R31  10  [0603]
R32  10  [0603]
R33  18K7  [0603]
R34  18K7  [0603]
R35  18K7  [0603]
TP14  Test point  [TP]  (value not drawn)
TP15  Test point  [TP]  (value not drawn)
TP16  Test point  [TP]  (value not drawn)
TP17  Test point  [TP]  (value not drawn)
TP20  Test point  [TP]  (value not drawn)
TP21  Test point  [TP]  (value not drawn)
TP22  Test point  [TP]  (value not drawn)
TP23  Test point  [TP]  (value not drawn)
U5  USBLC6-2SC6Y  [SOT23-6L]
U6  USB_type_A  Supplier Part Number 1: 538-67643-3911  [USB type A Right angle]
U7  MAX3232EUE  Supplier Part Number 1: 700-MAX3232EUE  [TSSOP 16]
U8  MAX3232EUE  Supplier Part Number 1: 700-MAX3232EUE  [TSSOP 16]

### Ports
+5V, GND, RS232_1_RX (bidir), RS232_1_TX (bidir), RS232_3_RX (bidir), RS232_3_TX (bidir), USB_DM (bidir), USB_DP (bidir), VDD, XBEE_RESET (bidir), XBEE_RSSI (bidir), XBEE_UART_CTS (bidir), XBEE_UART_DIN (bidir), XBEE_UART_DOUT (bidir), XBEE_UART_RTS (bidir)

### Nets
+5V: P8.1 P9.1 U5.5(Vbus) U6.1(VCC) ; port +5V
GND: C42.1 C43.1 C44.1 C47.1 C50.1 C51.1 C52.1 C53.1 C54.1 P4.10 P4.11 P4.14 P8.4 P9.4 Q1.2(S) Q2.2(S) Q3.2(S) R29.1 R33.2 R34.1 R35.1 U5.2(GND) U6.4(GND) U7.15(GND) U8.15(GND) ; port GND
VDD: C43.2 C44.2 C47.2 C50.2 P4.1 P5.1 P6.1 P7.1 U7.16(VCC) U8.16(VCC) ; port VDD
OTG_FS_DM: U5.1(I/O1) U5.6(I/O1) U6.2(D-) ; port USB_DM
OTG_FS_DP: U5.3(I/O2) U5.4(I/O2) U6.3(D+) ; port USB_DP
USART1_RX: TP20.1 U7.12(R1OUT) ; port RS232_3_RX
USART1_TX: TP22.1 U7.11(T1IN) ; port RS232_3_TX
USART3_CTS: P4.16 ; port XBEE_UART_CTS
USART3_RTS: P4.12 ; port XBEE_UART_RTS
USART3_RX: P4.2 TP14.1 ; port XBEE_UART_DIN
USART3_TX: P4.3 TP15.1 ; port XBEE_UART_DOUT
USART4_RX: TP21.1 U8.12(R1OUT) ; port RS232_1_RX
USART4_TX: TP23.1 U8.11(T1IN) ; port RS232_1_TX
XBEE_RESET: P4.5 TP16.1 ; port XBEE_RESET
XBEE_RSSI: P4.6 Q1.1(G) R33.1 TP17.1 ; port XBEE_RSSI
NetC42_2: C42.2 R29.2 U6.0(SHELL)
NetC45_1: C45.1 U7.5(C2-)
NetC45_2: C45.2 U7.4(C2+)
NetC46_1: C46.1 U7.3(C1-)
NetC46_2: C46.2 U7.1(C1+)
NetC48_1: C48.1 U8.5(C2-)
NetC48_2: C48.2 U8.4(C2+)
NetC49_1: C49.1 U8.3(C1-)
NetC49_2: C49.2 U8.1(C1+)
NetC51_2: C51.2 U7.2(V+)
NetC52_2: C52.2 U7.6(V-)
NetC53_2: C53.2 U8.2(V+)
NetC54_2: C54.2 U8.6(V-)
NetP4_13: P4.13 Q2.1(G) R34.2
NetP4_15: P4.15 Q3.1(G) R35.2
NetP5_2: P5.2 R30.2
NetP6_2: P6.2 R31.2
NetP7_2: P7.2 R32.2
NetP8_2: P8.2 U7.14(T1OUT)
NetP8_3: P8.3 U7.13(R1IN)
NetP9_2: P9.2 U8.14(T1OUT)
NetP9_3: P9.3 U8.13(R1IN)
NetQ1_3: Q1.3(D) R30.1
NetQ2_3: Q2.3(D) R31.1
NetQ3_3: Q3.3(D) R32.1

Not connected (* = marked no-connect by the designer): P4 4 7 8 9 17 18 19 20; U7 7(2TOUT) 8(R2IN) 9(R2OUT) 10(T2IN); U8 7(2TOUT) 8(R2IN) 9(R2OUT) 10(T2IN)

### Layout directives
differential pair: OTG_FS_DM, OTG_FS_DP

### Notes on the sheet
- USB
- XBee
- Front pannel RS232
- (near R34) Additional RS232 (if needed...)

### Library data of the parts
C42 = C_4.7nF: Capacitor; Supplier 1: Mouser; Supplier Part Number 1: 81-GCG188R92A472KA1D
C43 = C_47uF_25v_1206: Capacitor; Supplier 1: Mouser; Supplier Part Number 1: 810-C3216X5R1E476M
C44-C54 = C_220nF: Capacitor; Supplier 1: Mouser; Supplier Part Number 1: 81-GCG188R91H224KA1D
P5-P7 = Header 2p JST XA 3A right angle: Supplier 1: Digi-Key
Q1-Q3 = MOSFET_N_ 20V_1.4A: MOSFET N-Ch 20V 1.4A SOT-323-3; Supplier 1: Mouser; Supplier Part Number 1: 726-SP000917562
R29 = R_0603_01W_1M: 0.1W 1M; Supplier 1: Mouser; Supplier Part Number 1: 667-ERJ-3GEYJ105V
R30-R32 = R_0603_025W_10Ohm: 0.25W 10Ohm; Supplier 1: Mouser; Supplier Part Number 1: 667-ERJ-PA3J100V
R33-R35 = R_0603_01W_18K7: 0.1W 18K7; Supplier 1: Mouser; Supplier Part Number 1: 667-ERJ-3EKF1872V
U5 = USBLC6-2SC6Y: ESD Suppressors; Supplier 1: Mouser; Supplier Part Number 1: 511-USBLC6-2SC6Y
U6 = USB_type_A: USB type A; Supplier 1: Mouser
U7 U8 = MAX3232EUE: RS-232 Interface IC 3-5.5V 235kbps Transceiver; Supplier 1: Mouser
P4 = XBee receptacle: Supplier 1: Mouser; Supplier Part Number 1: 855-M22-7131042
P8 P9 = Header 4p JST XA 3A: Supplier 1: Digi-Key

## Sheet 1.1.5_Interface_board_Servos.SchDoc
size A4; DocumentNumber: 7; SheetNumber: 7; SheetTotal: 14
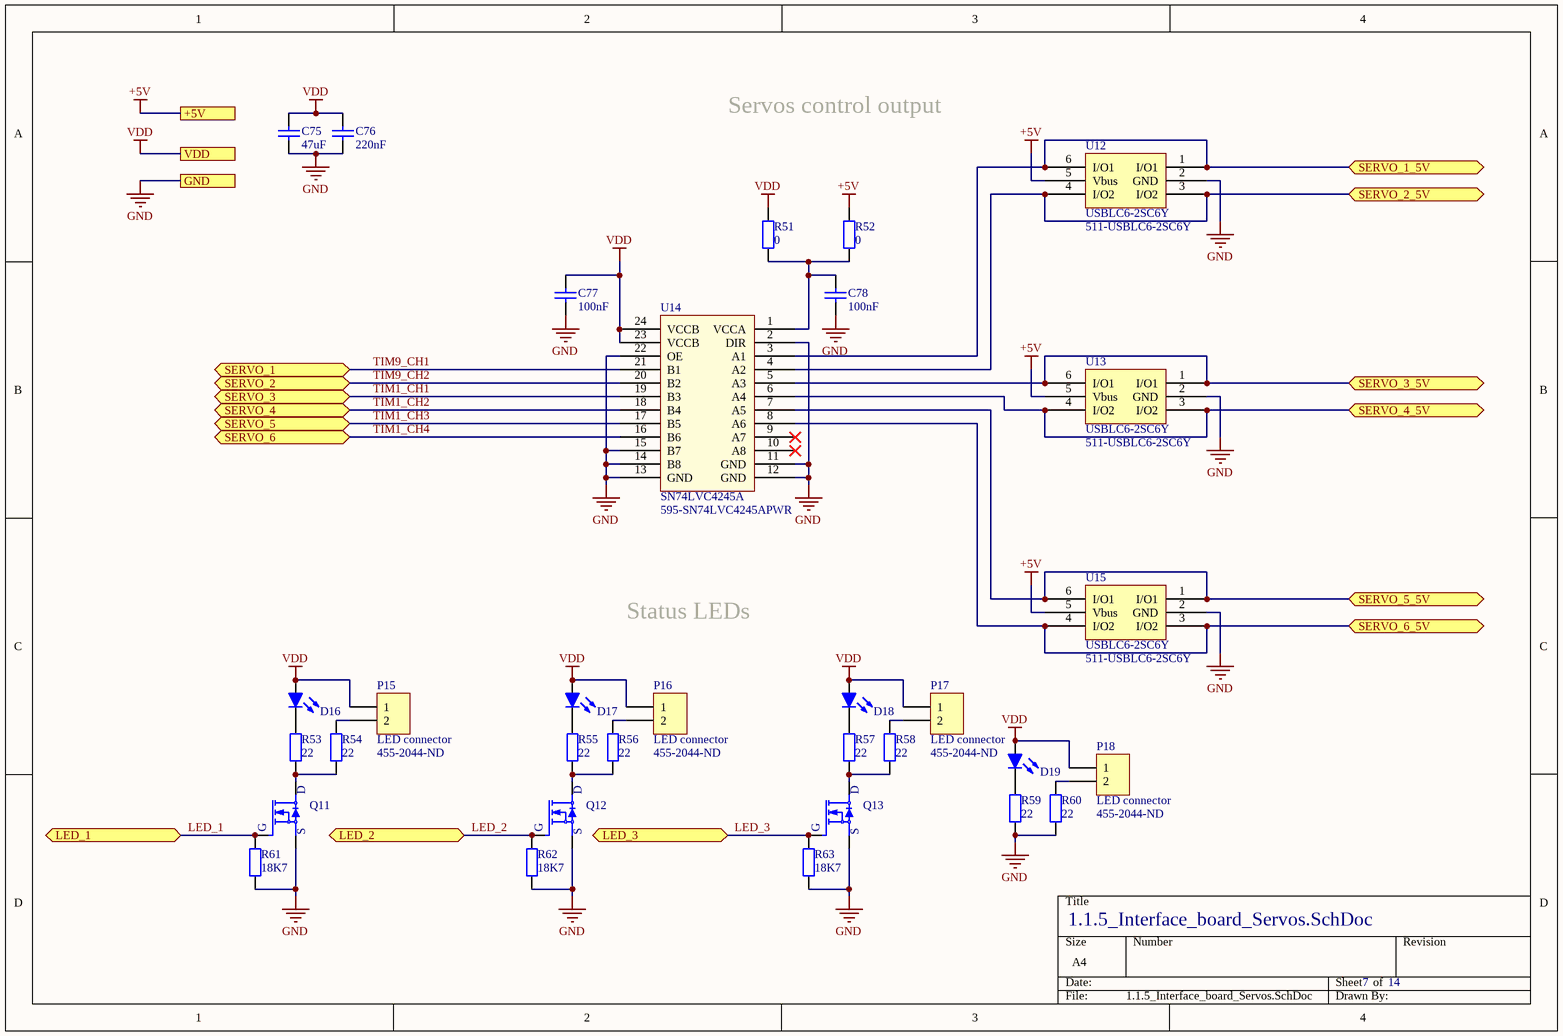
[diagram p5: 1.1.5_Interface_board_Servos.SchDoc]

### Parts
C75  47uF  [CAP1206W]
C76  220nF  [CAP0603R]
C77  100nF  [CAP0603R]
C78  100nF  [CAP0603R]
D16  LED  [WL-SMCW]  (value not drawn)
D17  LED  [WL-SMCW]  (value not drawn)
D18  LED  [WL-SMCW]  (value not drawn)
D19  LED  [WL-SMCW]  (value not drawn)
P15  LED connector  Supplier Part Number 1: 455-2044-ND  [CON_JST_XA_ S02B-XASS-1]
P16  LED connector  Supplier Part Number 1: 455-2044-ND  [CON_JST_XA_ S02B-XASS-1]
P17  LED connector  Supplier Part Number 1: 455-2044-ND  [CON_JST_XA_ S02B-XASS-1]
P18  LED connector  Supplier Part Number 1: 455-2044-ND  [CON_JST_XA_ S02B-XASS-1]
Q11  MOSFET_N  [SOT-323-3]  (value not drawn)
Q12  MOSFET_N  [SOT-323-3]  (value not drawn)
Q13  MOSFET_N  [SOT-323-3]  (value not drawn)
R51  0  [0603]
R52  0  [0603]
R53  22  [0603]
R54  22  [0603]
R55  22  [0603]
R56  22  [0603]
R57  22  [0603]
R58  22  [0603]
R59  22  [0603]
R60  22  [0603]
R61  18K7  [0603]
R62  18K7  [0603]
R63  18K7  [0603]
U12  USBLC6-2SC6Y  Supplier Part Number 1: 511-USBLC6-2SC6Y  [SOT23-6L]
U13  USBLC6-2SC6Y  Supplier Part Number 1: 511-USBLC6-2SC6Y  [SOT23-6L]
U14  SN74LVC4245A  Supplier Part Number 1: 595-SN74LVC4245APWR  [TSSOP 24]
U15  USBLC6-2SC6Y  Supplier Part Number 1: 511-USBLC6-2SC6Y  [SOT23-6L]

### Ports
+5V, GND, LED_1 (bidir), LED_2 (bidir), LED_3 (bidir), SERVO_1 (bidir), SERVO_1_5V (bidir), SERVO_2 (bidir), SERVO_2_5V (bidir), SERVO_3 (bidir), SERVO_3_5V (bidir), SERVO_4 (bidir), SERVO_4_5V (bidir), SERVO_5 (bidir), SERVO_5_5V (bidir), SERVO_6 (bidir), SERVO_6_5V (bidir), VDD

### Nets
+5V: R52.2 U12.5(Vbus) U13.5(Vbus) U15.5(Vbus) ; port +5V
GND: C75.1 C76.1 C77.1 C78.1 Q11.2(S) Q12.2(S) Q13.2(S) R59.1 R60.1 R61.1 R62.1 R63.1 U12.2(GND) U13.2(GND) U14.2(DIR) U14.11(GND) U14.12(GND) U14.13(GND) U14.14(B8) U14.15(B7) U14.22(OE) U15.2(GND) ; port GND
VDD: C75.2 C76.2 C77.2 D16.A D17.A D18.A D19.A P15.1 P16.1 P17.1 P18.1 R51.2 U14.23(VCCB) U14.24(VCCB) ; port VDD
LED_1: Q11.1(G) R61.2 ; port LED_1
LED_2: Q12.1(G) R62.2 ; port LED_2
LED_3: Q13.1(G) R63.2 ; port LED_3
TIM1_CH1: U14.19(B3) ; port SERVO_3
TIM1_CH2: U14.18(B4) ; port SERVO_4
TIM1_CH3: U14.17(B5) ; port SERVO_5
TIM1_CH4: U14.16(B6) ; port SERVO_6
TIM9_CH1: U14.21(B1) ; port SERVO_1
TIM9_CH2: U14.20(B2) ; port SERVO_2
NetC78_2: C78.2 R51.1 R52.1 U14.1(VCCA)
NetD16_C: D16.C R53.2
NetD17_C: D17.C R55.2
NetD18_C: D18.C R57.2
NetD19_C: D19.C R59.2
NetP1_28: U12.1(I/O1) U12.6(I/O1) U14.3(A1) ; port SERVO_1_5V
NetP1_30: U12.3(I/O2) U12.4(I/O2) U14.4(A2) ; port SERVO_2_5V
NetP1_32: U13.1(I/O1) U13.6(I/O1) U14.5(A3) ; port SERVO_3_5V
NetP1_34: U13.3(I/O2) U13.4(I/O2) U14.6(A4) ; port SERVO_4_5V
NetP1_36: U14.7(A5) U15.1(I/O1) U15.6(I/O1) ; port SERVO_5_5V
NetP1_38: U14.8(A6) U15.3(I/O2) U15.4(I/O2) ; port SERVO_6_5V
NetP15_2: P15.2 R54.2
NetP16_2: P16.2 R56.2
NetP17_2: P17.2 R58.2
NetP18_2: P18.2 R60.2
NetQ11_3: Q11.3(D) R53.1 R54.1
NetQ12_3: Q12.3(D) R55.1 R56.1
NetQ13_3: Q13.3(D) R57.1 R58.1

Not connected (* = marked no-connect by the designer): U14 9(A7)* 10(A8)*

### Notes on the sheet
- Servos control output
- Status LEDs

### Library data of the parts
C75 = C_47uF_25v_1206: Capacitor; Supplier 1: Mouser; Supplier Part Number 1: 810-C3216X5R1E476M
C76 = C_220nF: Capacitor; Supplier 1: Mouser; Supplier Part Number 1: 81-GCG188R91H224KA1D
C77 C78 = C_100nF: Capacitor; Supplier 1: Mouser; Supplier Part Number 1: 81-GCG188R91H104KA1D
D16-D19 = LED_SMD_GREEN_0603: Standard LEDs - SMD WL-SMCW Waterclr 0603 Green; Supplier 1: Mouser; Supplier Part Number 1: 710-150060GS75000
P15-P18 = Header 2p JST XA 3A right angle: Supplier 1: Digi-Key
Q11-Q13 = MOSFET_N_ 20V_1.4A: MOSFET N-Ch 20V 1.4A SOT-323-3; Supplier 1: Mouser; Supplier Part Number 1: 726-SP000917562
R51 R52 = R_0603_0Ohm_jumper: 0 Ohm; Supplier 1: Mouser; Supplier Part Number 1: 667-ERJ-3GEY0R00V
R53-R60 = R_0603_025W_22Ohm: 0.25W 22Ohm; LatestRevisionDate: 17-Jul-2002; LatestRevisionNote: Re-released for DXP Platform.; PackageReference: AXIAL-0.4; PackageDescription: Axial Device, Thru-Hole; 2 Leads; 0.4 in Pin Spacing; Supplier 1: Mouser; Supplier Part Number 1: 667-ERJ-PA3J220V
R61-R63 = R_0603_01W_18K7: 0.1W 18K7; Supplier 1: Mouser; Supplier Part Number 1: 667-ERJ-3EKF1872V
U12 U13 U15 = USBLC6-2SC6Y: ESD Suppressors; Supplier 1: Mouser
U14 = SN74LVC4245A: Level shifter 8; Supplier 1: Mouser

## Sheet 1.1.6_Interface_board_Pressure&IMU.SchDoc
size A4; DocumentNumber: 8; SheetNumber: 8; SheetTotal: 14
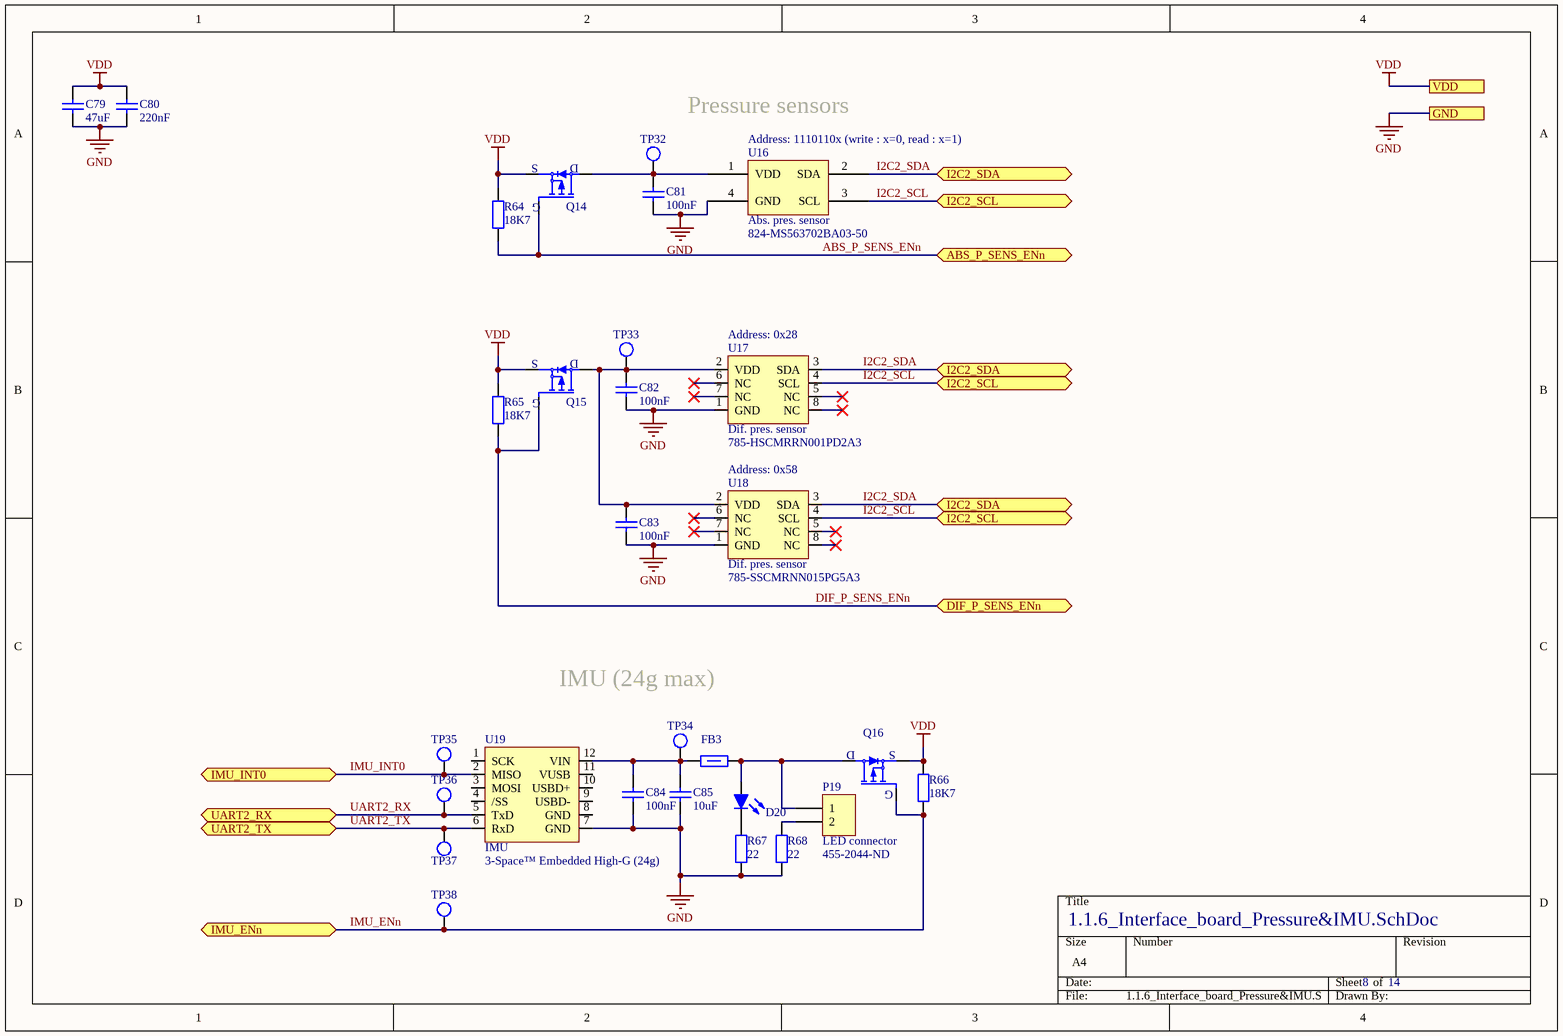
[diagram p6: 1.1.6_Interface_board_Pressure&IMU.SchDoc]

### Parts
C79  47uF  [CAP1206W]
C80  220nF  [CAP0603R]
C81  100nF  [CAP0603R]
C82  100nF  [CAP0603R]
C83  100nF  [CAP0603R]
C84  100nF  [CAP0603R]
C85  10uF  [CAP0805W]
D20  LED  [WL-SMCW]  (value not drawn)
FB3  81-BLM18KG601SZ1D  [0603]  (value not drawn)
P19  LED connector  Supplier Part Number 1: 455-2044-ND  [CON_JST_XA_ S02B-XASS-1]
Q14  MOSFET_P  [SOT23]  (value not drawn)
Q15  MOSFET_P  [SOT23]  (value not drawn)
Q16  MOSFET_P  [SOT23]  (value not drawn)
R64  18K7  [0603]
R65  18K7  [0603]
R66  18K7  [0603]
R67  22  [0603]
R68  22  [0603]
TP32  Test point  [TP]  (value not drawn)
TP33  Test point  [TP]  (value not drawn)
TP34  Test point  [TP]  (value not drawn)
TP35  Test point  [TP]  (value not drawn)
TP36  Test point  [TP]  (value not drawn)
TP37  Test point  [TP]  (value not drawn)
TP38  Test point  [TP]  (value not drawn)
U16  Abs. pres. sensor  Supplier Part Number 1: 824-MS563702BA03-50  [SMD_3.0X3.0MM_4P]
U17  Dif. pres. sensor  Supplier Part Number 1: 785-HSCMRRN001PD2A3  [HSCMRRN060PDSA3]
U18  Dif. pres. sensor  Supplier Part Number 1: 785-SSCMRNN015PG5A3  [HSCMRRN060PDSA3]
U19  IMU  Supplier Part Number 1: 3-Space™ Embedded High-G (24g)  [Yost Labs 3-Spac Embedded]

### Ports
ABS_P_SENS_ENn (bidir), DIF_P_SENS_ENn (bidir), GND, I2C2_SCL (bidir), I2C2_SDA (bidir), IMU_ENn (bidir), IMU_INT0 (bidir), UART2_RX (bidir), UART2_TX (bidir), VDD

### Nets
GND: C79.1 C80.1 C81.1 C82.1 C83.1 C84.1 C85.1 R67.1 R68.1 U16.4(GND) U17.1(GND) U18.1(GND) U19.7(GND) ; port GND
VDD: C79.2 C80.2 Q14.2(S) Q15.2(S) Q16.2(S) R64.2 R65.2 R66.2 ; port VDD
ABS_P_SENS_ENn: Q14.1(G) R64.1 ; port ABS_P_SENS_ENn
DIF_P_SENS_ENn: Q15.1(G) R65.1 ; port DIF_P_SENS_ENn
I2C2_SCL: U16.3(SCL) U17.4(SCL) U18.4(SCL) ; port I2C2_SCL
I2C2_SDA: U16.2(SDA) U17.3(SDA) U18.3(SDA) ; port I2C2_SDA
IMU_ENn: Q16.1(G) R66.1 TP38.1 ; port IMU_ENn
IMU_INT0: TP35.1 U19.2(MISO) ; port IMU_INT0
UART2_RX: TP36.1 U19.5(TxD) ; port UART2_RX
UART2_TX: TP37.1 U19.6(RxD) ; port UART2_TX
NetC81_2: C81.2 Q14.3(D) TP32.1 U16.1(VDD)
NetC82_2: C82.2 C83.2 Q15.3(D) TP33.1 U17.2(VDD) U18.2(VDD)
NetC84_2: C84.2 C85.2 FB3.1 TP34.1 U19.12(VIN)
NetD20_A: D20.A FB3.2 P19.1 Q16.3(D)
NetD20_C: D20.C R67.2
NetP19_2: P19.2 R68.2

Not connected (* = marked no-connect by the designer): U17 5(NC)* 6(NC)* 7(NC)* 8(NC)*; U18 5(NC)* 6(NC)* 7(NC)* 8(NC)*; U19 1(SCK) 3(MOSI) 4(/SS) 8(GND) 9(USBD-) 10(USBD+) 11(VUSB)

### Notes on the sheet
- Pressure sensors
- (near U16) Address: 1110110x (write : x=0, read : x=1)
- (near U17) Address: 0x28
- (near U18) Address: 0x58
- IMU (24g max)

### Library data of the parts
C79 = C_47uF_25v_1206: Capacitor; Supplier 1: Mouser; Supplier Part Number 1: 810-C3216X5R1E476M
C80 = C_220nF: Capacitor; Supplier 1: Mouser; Supplier Part Number 1: 81-GCG188R91H224KA1D
C81-C84 = C_100nF: Capacitor; Supplier 1: Mouser; Supplier Part Number 1: 81-GCG188R91H104KA1D
C85 = C_10uF_16v: Capacitor; Supplier 1: Mouser; Supplier Part Number 1: 81-GRT21BC81C106ME1L
D20 = LED_SMD_GREEN_0603: as D16 on sheet 1.1.5_Interface_board_Servos; Supplier 1: Mouser; Supplier Part Number 1: 710-150060GS75000
FB3 = Ferrite_bead: Supplier 1: Mouser; Supplier Part Number 1: 81-BLM18KG601SZ1D
P19 = Header 2p JST XA 3A right angle: Supplier 1: Digi-Key
Q14-Q16 = MOSFET_P_ 20V_1.5A: MOSFET 40V P-channel Trench MOSFET SOT-23-3; Supplier 1: Mouser; Supplier Part Number 1: 771-PMV250EPEAR
R64-R66 = R_0603_01W_18K7: 0.1W 18K7; Supplier 1: Mouser; Supplier Part Number 1: 667-ERJ-3EKF1872V
R67 R68 = R_0603_025W_22Ohm: 0.25W 22Ohm; LatestRevisionDate: 17-Jul-2002; LatestRevisionNote: Re-released for DXP Platform.; PackageReference: AXIAL-0.4; PackageDescription: Axial Device, Thru-Hole; 2 Leads; 0.4 in Pin Spacing; Supplier 1: Mouser; Supplier Part Number 1: 667-ERJ-PA3J220V
U16 = MS563702BA03-50: Pressure sensor; Supplier 1: Mouser
U17 = HSCMRRN001PD2A3: Diff pressure sensor 1 psi; Supplier 1: Mouser
U18 = SSCMRNN015PG5A3: Diff pressure sensor 0 psi to 15 psi; Supplier 1: Mouser
U19 = YostLab_3-Space_Embedded: Supplier 1: Yost Labs

## Sheet 1.1.7_Interface_board_GNSS.SchDoc
size A4; DocumentNumber: 9; SheetNumber: 9; SheetTotal: 14
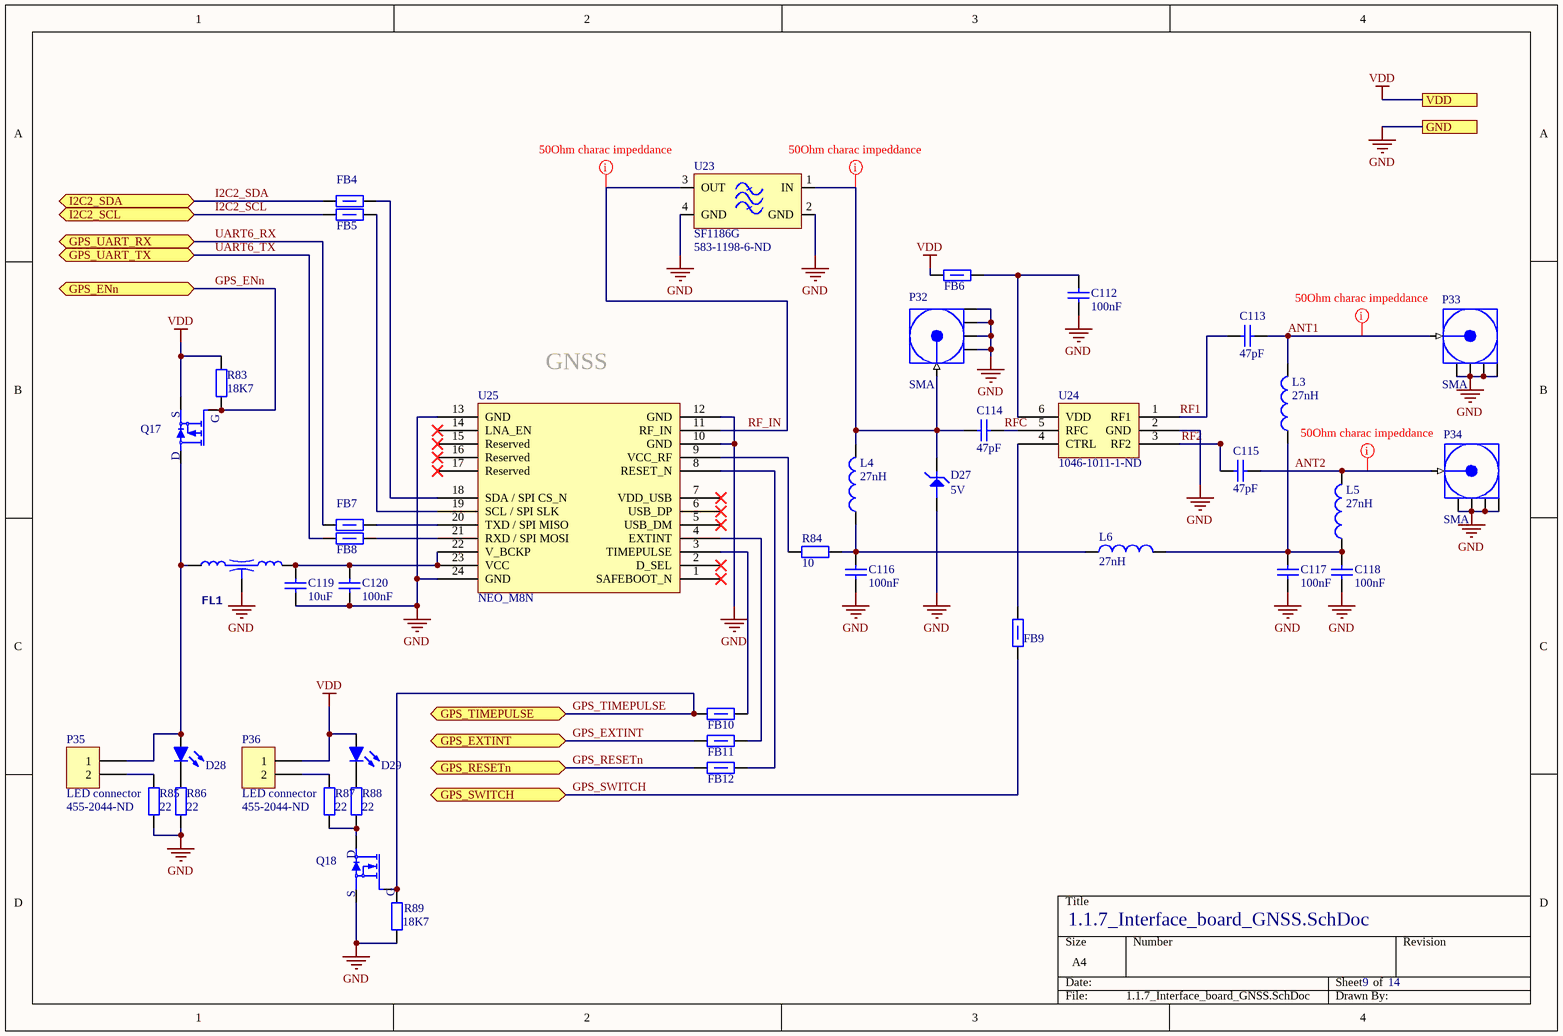
[diagram p7: 1.1.7_Interface_board_GNSS.SchDoc]

### Parts
C112  100nF  [CAP0603R]
C113  47pF  [0402]
C114  47pF  [0402]
C115  47pF  [0402]
C116  100nF  [CAP0603R]
C117  100nF  [CAP0603R]
C118  100nF  [CAP0603R]
C119  10uF  [CAP0805W]
C120  100nF  [CAP0603R]
D27  5V  [SOD-923]
D28  LED  [WL-SMCW]  (value not drawn)
D29  LED  [WL-SMCW]  (value not drawn)
FB4  81-BLM18KG601SZ1D  [0603]  (value not drawn)
FB5  81-BLM18KG601SZ1D  [0603]  (value not drawn)
FB6  81-BLM18KG601SZ1D  [0603]  (value not drawn)
FB7  81-BLM18KG601SZ1D  [0603]  (value not drawn)
FB8  81-BLM18KG601SZ1D  [0603]  (value not drawn)
FB9  81-BLM18KG601SZ1D  [0603]  (value not drawn)
FB10  81-BLM18KG601SZ1D  [0603]  (value not drawn)
FB11  81-BLM18KG601SZ1D  [0603]  (value not drawn)
FB12  81-BLM18KG601SZ1D  [0603]  (value not drawn)
FL1  NFE31P Series (1206 Size)   Chip EMIFILr LC Combined Type  [LCL_NFE31P]  (value not drawn)
L3  27nH  [0402]
L4  27nH  [0402]
L5  27nH  [0402]
L6  27nH  [0402]
P32  SMA  [SMA_TH_VERTICAL_LONG]
P33  SMA  [SMA_TH_VERTICAL_LONG]
P34  SMA  [SMA_TH_VERTICAL_LONG]
P35  LED connector  Supplier Part Number 1: 455-2044-ND  [CON_JST_XA_ S02B-XASS-1]
P36  LED connector  Supplier Part Number 1: 455-2044-ND  [CON_JST_XA_ S02B-XASS-1]
Q17  MOSFET_P  [SOT23]  (value not drawn)
Q18  MOSFET_N  [SOT-323-3]  (value not drawn)
R83  18K7  [0603]
R84  10  [0603]
R85  22  [0603]
R86  22  [0603]
R87  22  [0603]
R88  22  [0603]
R89  18K7  [0603]
U23  SF1186G  Supplier Part Number 1: 583-1198-6-ND  [SMD_2.5X2MM_4P]
U24  Supplier Part Number 1: 1046-1011-1-ND  [SC-70]  (hidden comment: PE4259)
U25  Supplier Part Number 1: NEO_M8N  [NEO-8]  (hidden comment: NEO_M8)

### Ports
GND, GPS_ENn (bidir), GPS_EXTINT (bidir), GPS_RESETn (bidir), GPS_SWITCH (bidir), GPS_TIMEPULSE (bidir), GPS_UART_RX (bidir), GPS_UART_TX (bidir), I2C2_SCL (bidir), I2C2_SDA (bidir), VDD

### Nets
GND: C112.1 C116.1 C117.1 C118.1 C119.1 C120.1 D27.2 FL1.2 P32.2 P32.3 P32.4 P32.5 P33.2 P33.3 P33.4 P33.5 P34.2 P34.3 P34.4 P34.5 Q18.2(S) R85.1 R86.1 R89.2 U23.2(GND) U23.4(GND) U24.2(GND) U25.10(GND) U25.12(GND) U25.13(GND) U25.24(GND) ; port GND
VDD: D29.A FB6.2 P36.1 Q17.2(S) R83.2 ; port VDD
ANT1: C113.1 L3.2 P33.1
ANT2: C115.1 L5.2 P34.1
GPS_ENn: Q17.1(G) R83.1 ; port GPS_ENn
GPS_EXTINT: FB11.2 ; port GPS_EXTINT
GPS_RESETn: FB12.2 ; port GPS_RESETn
GPS_SWITCH: FB9.1 ; port GPS_SWITCH
GPS_TIMEPULSE: FB10.2 Q18.1(G) R89.1 ; port GPS_TIMEPULSE
I2C2_SCL: FB5.1 ; port I2C2_SCL
I2C2_SDA: FB4.1 ; port I2C2_SDA
RF1: C113.2 U24.1(RF1)
RF2: C115.2 U24.3(RF2)
RF_IN: U23.3(OUT) U25.11(RF_IN)
RFC: C114.1 U24.5(RFC)
UART6_RX: FB7.1 ; port GPS_UART_RX
UART6_TX: FB8.1 ; port GPS_UART_TX
NetC112_2: C112.2 FB6.1 U24.6(VDD)
NetC114_2: C114.2 D27.1 L4.2 P32.1 U23.1(IN)
NetC116_2: C116.2 L4.1 L6.1 R84.2
NetC117_2: C117.2 C118.2 L3.1 L5.1 L6.2
NetC119_2: C119.2 C120.2 FL1.3 U25.22(V_BCKP) U25.23(VCC)
NetD28_A: D28.A FL1.1 P35.1 Q17.3(D)
NetD28_C: D28.C R86.2
NetD29_C: D29.C R88.2
NetFB4_2: FB4.2 U25.18(SDA_/_SPI_CS_N)
NetFB5_2: FB5.2 U25.19(SCL_/_SPI_SLK)
NetFB7_2: FB7.2 U25.20(TXD_/_SPI_MISO)
NetFB8_2: FB8.2 U25.21(RXD_/_SPI_MOSI)
NetFB9_2: FB9.2 U24.4(CTRL)
NetFB10_1: FB10.1 U25.3(TIMEPULSE)
NetFB11_1: FB11.1 U25.4(EXTINT)
NetFB12_1: FB12.1 U25.8(RESET_N)
NetP35_2: P35.2 R85.2
NetP36_2: P36.2 R87.2
NetQ18_3: Q18.3(D) R87.1 R88.1
NetR84_1: R84.1 U25.9(VCC_RF)

Not connected (* = marked no-connect by the designer): U25 1(SAFEBOOT_N)* 2(D_SEL)* 5(USB_DM)* 6(USB_DP)* 7(VDD_USB)* 14(LNA_EN)* 15(Reserved)* 16(Reserved)* 17(Reserved)*

### Layout directives
rule Undefined: ANT1, ANT2, NetC114_2, RF_IN

### Notes on the sheet
- (near U25) GNSS

### Library data of the parts
C112 C116-C118 C120 = C_100nF: Capacitor; Supplier 1: Mouser; Supplier Part Number 1: 81-GCG188R91H104KA1D
C113-C115 = C_47pF_50V_0402: Capacitor; Supplier 1: Mouser; Supplier Part Number 1: 810-CGA2B2C0G1H470J
C119 = C_10uF_16v: Capacitor; Supplier 1: Mouser; Supplier Part Number 1: 81-GRT21BC81C106ME1L
D27 = ESD9L5.0ST5G: Diodes TVS - Parasurtenseurs ESD; Supplier 1: Mouser; Supplier Part Number 1: 863-ESD9L5.0ST5G
D28 D29 = LED_SMD_GREEN_0603: as D16 on sheet 1.1.5_Interface_board_Servos; Supplier 1: Mouser; Supplier Part Number 1: 710-150060GS75000
FB4-FB12 = Ferrite_bead: Supplier 1: Mouser; Supplier Part Number 1: 81-BLM18KG601SZ1D
FL1 = NFE31P: Supplier 1: Mouser; Supplier Part Number 1: 81-NFE31PT222Z1E9L
L3-L6 = L_27nH_0402: Inductor; Supplier 1: Mouser; Supplier Part Number 1: 81-LQG15HS27NJ02D
P32-P34 = COAX_SMA_PCB: Connecteurs coaxiaux SMA STRAIGHT JACK PCB MOUNT BULKHEAD; Supplier 1: Mouser; Supplier Part Number 1: 523-132291
P35 P36 = Header 2p JST XA 3A right angle: Supplier 1: Digi-Key
Q17 = MOSFET_P_ 20V_1.5A: as Q14 on sheet 1.1.6_Interface_board_Pressure&IMU; Supplier 1: Mouser; Supplier Part Number 1: 771-PMV250EPEAR
Q18 = MOSFET_N_ 20V_1.4A: MOSFET N-Ch 20V 1.4A SOT-323-3; Supplier 1: Mouser; Supplier Part Number 1: 726-SP000917562
R83 R89 = R_0603_01W_18K7: 0.1W 18K7; Supplier 1: Mouser; Supplier Part Number 1: 667-ERJ-3EKF1872V
R84 = R_0603_025W_10Ohm: 0.25W 10Ohm; Supplier 1: Mouser; Supplier Part Number 1: 667-ERJ-PA3J100V
R85-R88 = R_0603_025W_22Ohm: 0.25W 22Ohm; LatestRevisionDate: 17-Jul-2002; LatestRevisionNote: Re-released for DXP Platform.; PackageReference: AXIAL-0.4; PackageDescription: Axial Device, Thru-Hole; 2 Leads; 0.4 in Pin Spacing; Supplier 1: Mouser; Supplier Part Number 1: 667-ERJ-PA3J220V
U23 = SF1186G: SAW GPS Filter; Supplier 1: Digi-Key
U24 = PE4259: RF SWITCH; Supplier 1: Digi-Key
U25 = uBlox_Neo M8: GNSS; Supplier 1: uBlox

## Nets that join several sheets
+5V: 1.1.0_Interface_board (6 pins), 1.1.2_Interface_board_Power_Supply (6 pins), 1.1.4_Interface_board_USB&XBee&RS232 (P8.1 P9.1 U5.5 U6.1), 1.1.5_Interface_board_Servos (R52.2 U12.5 U13.5 U15.5)
GND: 1.1.0_Interface_board (23 pins), 1.1.1_Interface_board_MCU (18 pins), 1.1.2_Interface_board_Power_Supply (41 pins), 1.1.3_Interface_board_SWD&FLASH&IO (30 pins), 1.1.4_Interface_board_USB&XBee&RS232 (25 pins), 1.1.5_Interface_board_Servos (22 pins), 1.1.6_Interface_board_Pressure&IMU (13 pins), 1.1.7_Interface_board_GNSS (31 pins)
VDD: 1.1.1_Interface_board_MCU (6 pins), 1.1.2_Interface_board_Power_Supply (39 pins), 1.1.3_Interface_board_SWD&FLASH&IO (14 pins), 1.1.4_Interface_board_USB&XBee&RS232 (10 pins), 1.1.5_Interface_board_Servos (14 pins), 1.1.6_Interface_board_Pressure&IMU (8 pins), 1.1.7_Interface_board_GNSS (5 pins)
ABS_P_SENS_ENn: 1.1.1_Interface_board_MCU (U1.35), 1.1.6_Interface_board_Pressure&IMU (Q14.1 R64.1)
ADC123_IN1: 1.1.0_Interface_board (P1.16), 1.1.1_Interface_board_MCU (U1.24)
ADC123_IN2: 1.1.0_Interface_board (P1.18), 1.1.1_Interface_board_MCU (U1.25)
ADC123_IN3: 1.1.0_Interface_board (P1.20), 1.1.1_Interface_board_MCU (U1.26)
ADC123_IN4: 1.1.0_Interface_board (P1.22), 1.1.1_Interface_board_MCU (U1.29)
AUX_I/O_1: 1.1.1_Interface_board_MCU (U1.30), 1.1.3_Interface_board_SWD&FLASH&IO (D5.3 P3.2 R10.1 R17.2)
AUX_I/O_2: 1.1.1_Interface_board_MCU (U1.31), 1.1.3_Interface_board_SWD&FLASH&IO (D6.3 P3.3 R11.1 R18.2)
AUX_I/O_3: 1.1.1_Interface_board_MCU (U1.32), 1.1.3_Interface_board_SWD&FLASH&IO (D7.3 P3.4 R12.1 R19.2)
AUX_I/O_4: 1.1.1_Interface_board_MCU (U1.67), 1.1.3_Interface_board_SWD&FLASH&IO (D8.3 P3.5 R13.1 R20.2)
AUX_I/O_5: 1.1.1_Interface_board_MCU (U1.68), 1.1.3_Interface_board_SWD&FLASH&IO (D9.3 P3.6 R14.1 R21.2)
AUX_I/O_6: 1.1.1_Interface_board_MCU (U1.69), 1.1.3_Interface_board_SWD&FLASH&IO (D10.3 P3.7 R15.1 R22.2)
BOOT0: 1.1.1_Interface_board_MCU (U1.94), 1.1.3_Interface_board_SWD&FLASH&IO (R23.1 R24.2 R25.2)
BOOT1: 1.1.1_Interface_board_MCU (U1.37), 1.1.3_Interface_board_SWD&FLASH&IO (R26.1 R27.2 R28.2)
BUZZER: 1.1.0_Interface_board (P1.24), 1.1.1_Interface_board_MCU (U1.61)
DIF_P_SENS_ENn: 1.1.1_Interface_board_MCU (U1.36), 1.1.6_Interface_board_Pressure&IMU (Q15.1 R65.1)
FLASH_HOLD: 1.1.1_Interface_board_MCU (U1.82), 1.1.3_Interface_board_SWD&FLASH&IO (U4.7)
FLASH_WP: 1.1.1_Interface_board_MCU (U1.81), 1.1.3_Interface_board_SWD&FLASH&IO (U4.3)
GPS_ENn: 1.1.1_Interface_board_MCU (U1.34), 1.1.7_Interface_board_GNSS (Q17.1 R83.1)
GPS_EXTINT: 1.1.1_Interface_board_MCU (U1.18), 1.1.7_Interface_board_GNSS (FB11.2)
GPS_RESETn: 1.1.1_Interface_board_MCU (U1.65), 1.1.7_Interface_board_GNSS (FB12.2)
GPS_SWITCH: 1.1.1_Interface_board_MCU (U1.66), 1.1.7_Interface_board_GNSS (FB9.1)
GPS_TIMEPULSE: 1.1.1_Interface_board_MCU (U1.95), 1.1.7_Interface_board_GNSS (FB10.2 Q18.1 R89.1)
I2C2_SCL: 1.1.1_Interface_board_MCU (R1.1 TP2.1 U1.47), 1.1.6_Interface_board_Pressure&IMU (U16.3 U17.4 U18.4), 1.1.7_Interface_board_GNSS (FB5.1)
I2C2_SDA: 1.1.1_Interface_board_MCU (R2.1 TP3.1 U1.48), 1.1.6_Interface_board_Pressure&IMU (U16.2 U17.3 U18.3), 1.1.7_Interface_board_GNSS (FB4.1)
IMU_ENn: 1.1.1_Interface_board_MCU (U1.83), 1.1.6_Interface_board_Pressure&IMU (Q16.1 R66.1 TP38.1)
IMU_INT0: 1.1.1_Interface_board_MCU (U1.96), 1.1.6_Interface_board_Pressure&IMU (TP35.1 U19.2)
LED_1: 1.1.1_Interface_board_MCU (U1.15), 1.1.5_Interface_board_Servos (Q11.1 R61.2)
LED_2: 1.1.1_Interface_board_MCU (U1.16), 1.1.5_Interface_board_Servos (Q12.1 R62.2)
LED_3: 1.1.1_Interface_board_MCU (U1.17), 1.1.5_Interface_board_Servos (Q13.1 R63.2)
NetP1_28: 1.1.0_Interface_board (P1.28), 1.1.5_Interface_board_Servos (U12.1 U12.6 U14.3)
NetP1_30: 1.1.0_Interface_board (P1.30), 1.1.5_Interface_board_Servos (U12.3 U12.4 U14.4)
NetP1_32: 1.1.0_Interface_board (P1.32), 1.1.5_Interface_board_Servos (U13.1 U13.6 U14.5)
NetP1_34: 1.1.0_Interface_board (P1.34), 1.1.5_Interface_board_Servos (U13.3 U13.4 U14.6)
NetP1_36: 1.1.0_Interface_board (P1.36), 1.1.5_Interface_board_Servos (U14.7 U15.1 U15.6)
NetP1_38: 1.1.0_Interface_board (P1.38), 1.1.5_Interface_board_Servos (U14.8 U15.3 U15.4)
NRST: 1.1.1_Interface_board_MCU (R4.1 U1.14), 1.1.3_Interface_board_SWD&FLASH&IO (D4.3 R16.2)
OTG_FS_DM: 1.1.1_Interface_board_MCU (U1.70), 1.1.4_Interface_board_USB&XBee&RS232 (U5.1 U5.6 U6.2)
OTG_FS_DP: 1.1.1_Interface_board_MCU (U1.71), 1.1.4_Interface_board_USB&XBee&RS232 (U5.3 U5.4 U6.3)
SPI2_MISO: 1.1.1_Interface_board_MCU (U1.53), 1.1.3_Interface_board_SWD&FLASH&IO (TP12.1 U4.2)
SPI2_MOSI: 1.1.1_Interface_board_MCU (U1.54), 1.1.3_Interface_board_SWD&FLASH&IO (TP13.1 U4.5)
SPI2_NSS: 1.1.1_Interface_board_MCU (U1.51), 1.1.3_Interface_board_SWD&FLASH&IO (TP10.1 U4.1)
SPI2_SCK: 1.1.1_Interface_board_MCU (U1.52), 1.1.3_Interface_board_SWD&FLASH&IO (TP11.1 U4.6)
SWCLK: 1.1.1_Interface_board_MCU (U1.76), 1.1.3_Interface_board_SWD&FLASH&IO (D2.3 R8.2)
SWDIO: 1.1.1_Interface_board_MCU (U1.72), 1.1.3_Interface_board_SWD&FLASH&IO (D1.3 R7.2)
SWO: 1.1.1_Interface_board_MCU (U1.89), 1.1.3_Interface_board_SWD&FLASH&IO (D3.3 R9.2)
TIM1_CH1: 1.1.1_Interface_board_MCU (U1.40), 1.1.5_Interface_board_Servos (U14.19)
TIM1_CH2: 1.1.1_Interface_board_MCU (U1.42), 1.1.5_Interface_board_Servos (U14.18)
TIM1_CH3: 1.1.1_Interface_board_MCU (U1.44), 1.1.5_Interface_board_Servos (U14.17)
TIM1_CH4: 1.1.1_Interface_board_MCU (U1.45), 1.1.5_Interface_board_Servos (U14.16)
TIM9_CH1: 1.1.1_Interface_board_MCU (U1.4), 1.1.5_Interface_board_Servos (U14.21)
TIM9_CH2: 1.1.1_Interface_board_MCU (U1.5), 1.1.5_Interface_board_Servos (U14.20)
UART2_RX: 1.1.1_Interface_board_MCU (U1.87), 1.1.6_Interface_board_Pressure&IMU (TP36.1 U19.5)
UART2_TX: 1.1.1_Interface_board_MCU (U1.86), 1.1.6_Interface_board_Pressure&IMU (TP37.1 U19.6)
UART6_RX: 1.1.1_Interface_board_MCU (U1.64), 1.1.7_Interface_board_GNSS (FB7.1)
UART6_TX: 1.1.1_Interface_board_MCU (U1.63), 1.1.7_Interface_board_GNSS (FB8.1)
USART1_RX: 1.1.1_Interface_board_MCU (U1.93), 1.1.4_Interface_board_USB&XBee&RS232 (TP20.1 U7.12)
USART1_TX: 1.1.1_Interface_board_MCU (U1.92), 1.1.4_Interface_board_USB&XBee&RS232 (TP22.1 U7.11)
USART3_CTS: 1.1.1_Interface_board_MCU (U1.58), 1.1.4_Interface_board_USB&XBee&RS232 (P4.16)
USART3_RTS: 1.1.1_Interface_board_MCU (U1.59), 1.1.4_Interface_board_USB&XBee&RS232 (P4.12)
USART3_RX: 1.1.1_Interface_board_MCU (U1.56), 1.1.4_Interface_board_USB&XBee&RS232 (P4.2 TP14.1)
USART3_TX: 1.1.1_Interface_board_MCU (U1.55), 1.1.4_Interface_board_USB&XBee&RS232 (P4.3 TP15.1)
USART4_RX: 1.1.1_Interface_board_MCU (U1.79), 1.1.4_Interface_board_USB&XBee&RS232 (TP21.1 U8.12)
USART4_TX: 1.1.1_Interface_board_MCU (U1.78), 1.1.4_Interface_board_USB&XBee&RS232 (TP23.1 U8.11)
XBEE_RESET: 1.1.1_Interface_board_MCU (U1.60), 1.1.4_Interface_board_USB&XBee&RS232 (P4.5 TP16.1)
XBEE_RSSI: 1.1.1_Interface_board_MCU (U1.33), 1.1.4_Interface_board_USB&XBee&RS232 (P4.6 Q1.1 R33.1 TP17.1)